# Altium project MU_MP_39_V1.PrjPcb (part 1 of 5)
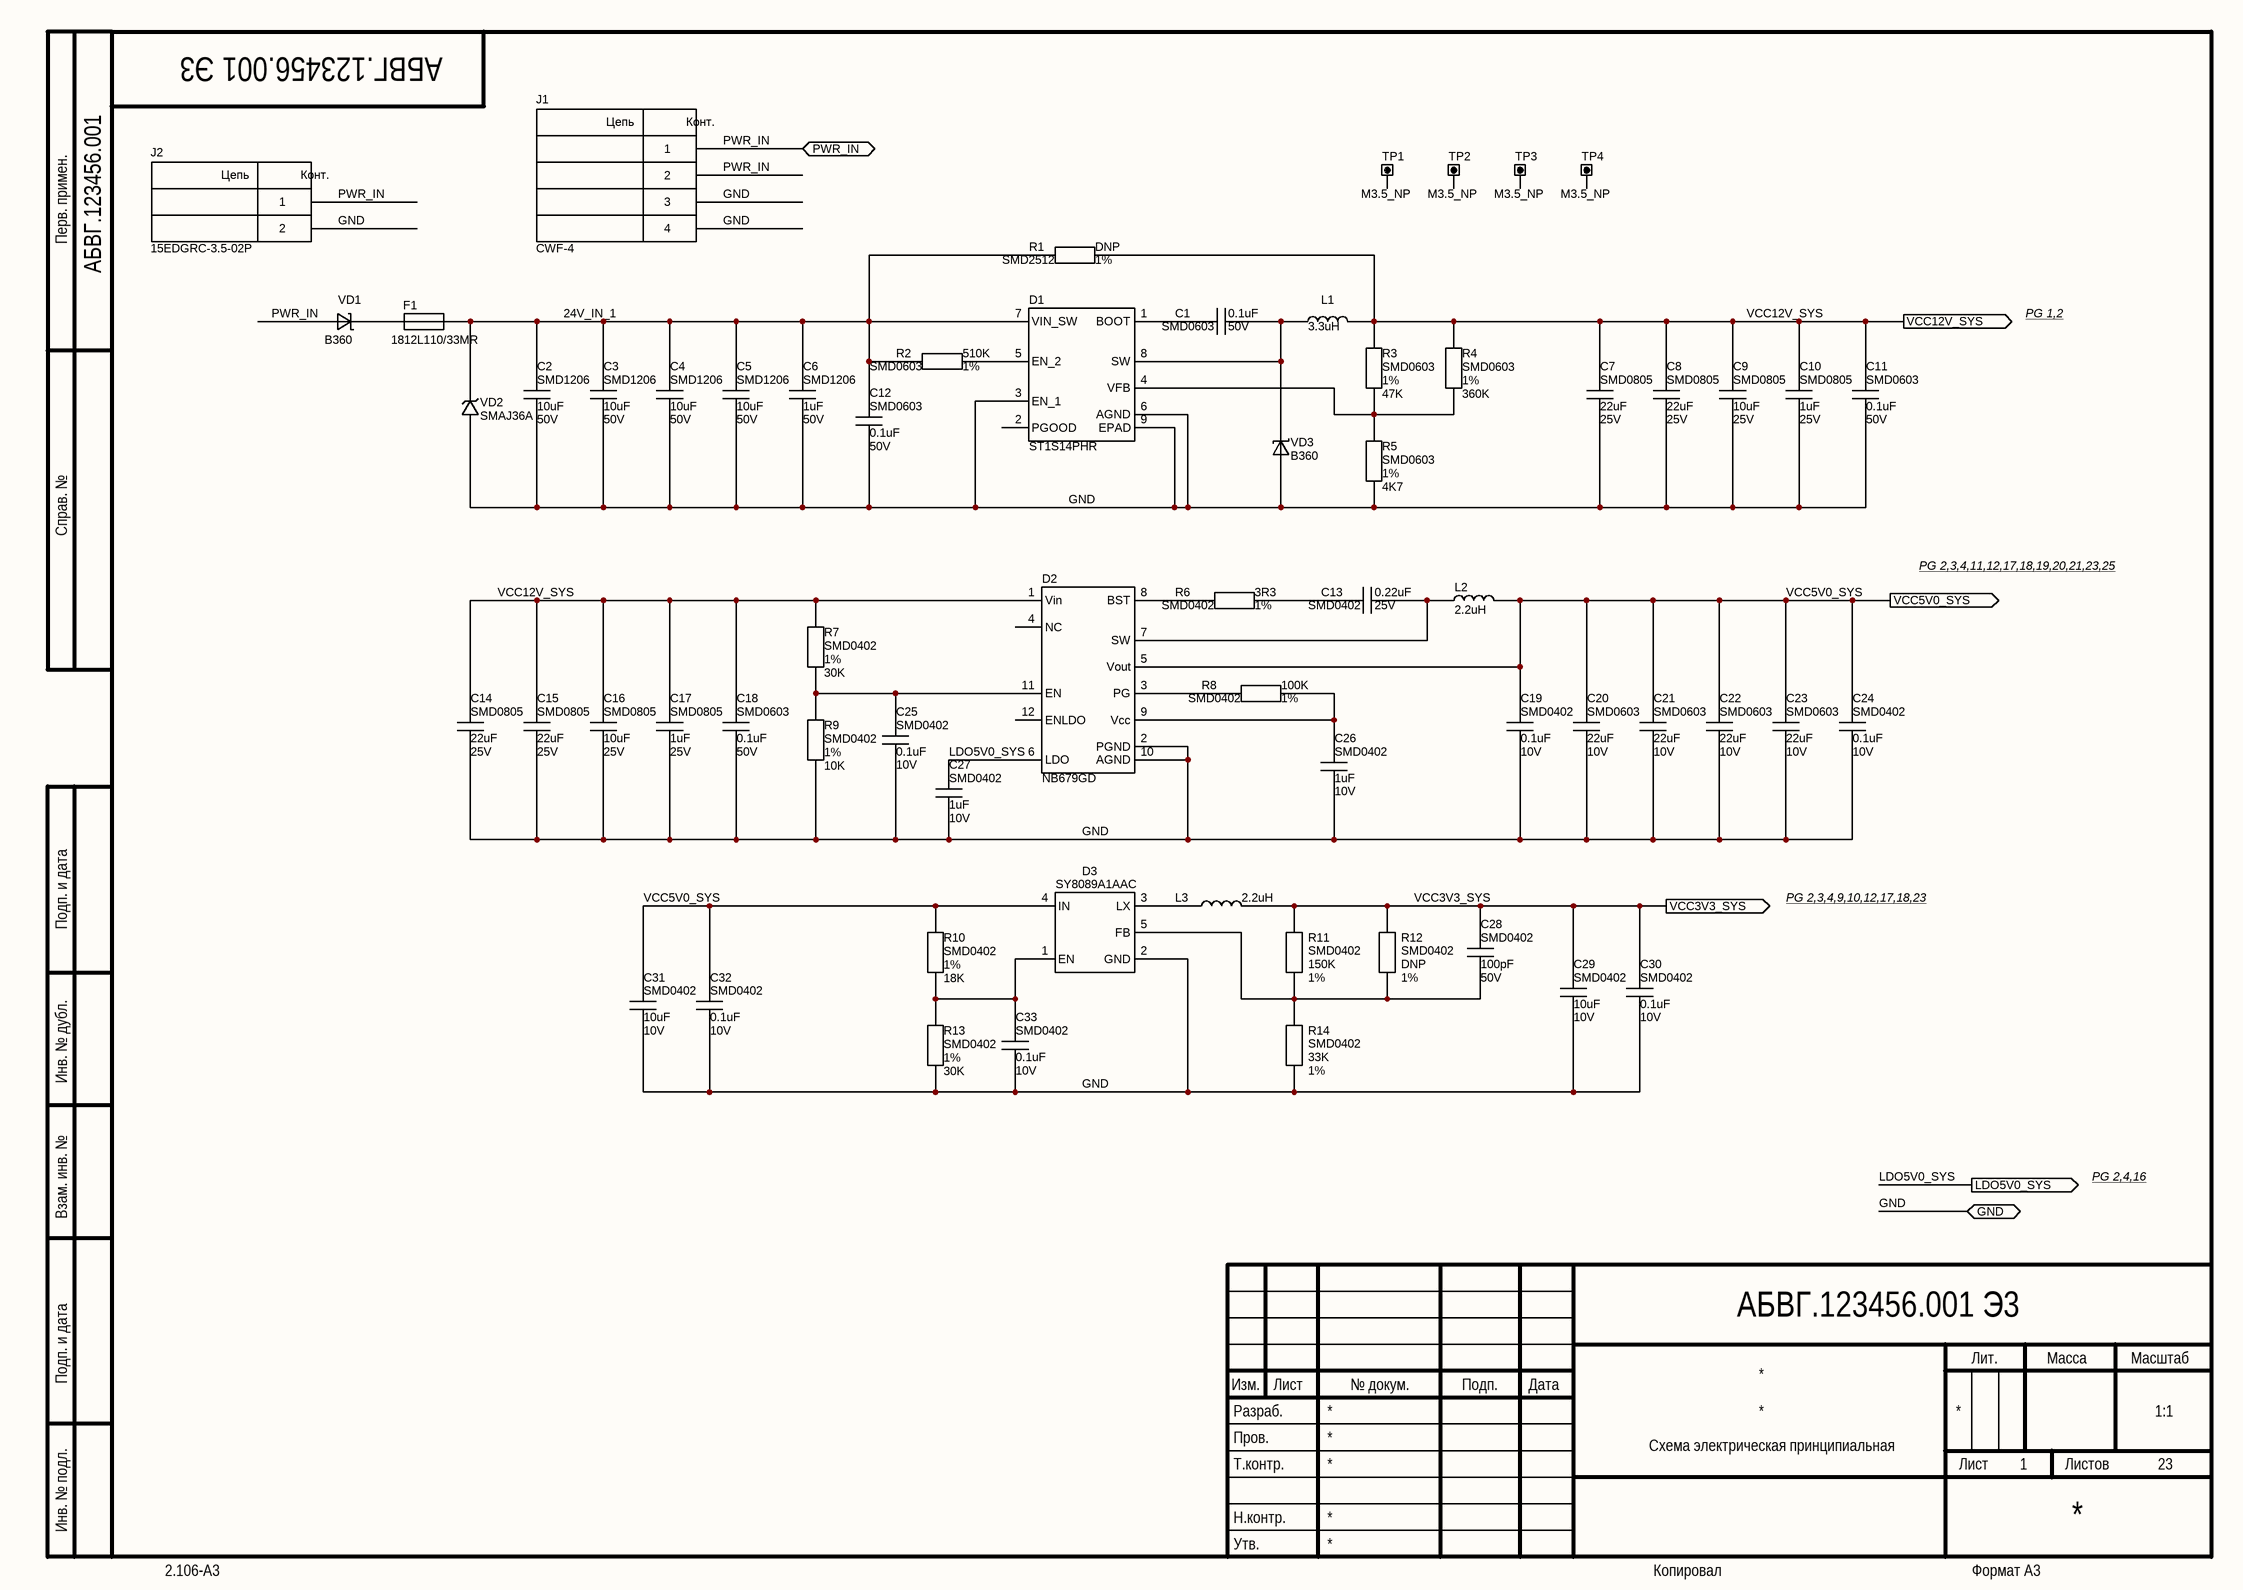
[diagram p0: 01 INPUT_PWR.SchDoc]
23 sheets, 934 parts. Net scope: flat (ports and power ports of the same name join across sheets).
Board file: MU_MP_39_V1.PcbDoc
Sheets:
  01 INPUT_PWR.SchDoc
  02 INPUT_PWR_2.SchDoc
  03 RK808.SchDoc
  04 POWER.SchDoc
  05 CPU_PWR.SchDoc
  06 CPU_RAM.SchDoc
  07 RAM_PWR.SchDoc
  08 RAM.SchDoc
  09 EMMC.SchDoc
  10 SDMMC.SchDoc
  11 USB_2.SchDoc
  12 USB_3.SchDoc
  13 CPU_1.SchDoc
  14 CPU_2.SchDoc
  15 ETHERNET.SchDoc
  16 HDMI.SchDoc
  17 EDP.SchDoc
  18 I2S.SchDoc
  19 RADIATOR.SchDoc
  20 WiFi_BT.SchDoc
  21 CAN.SchDoc
  22 PCIE.SchDoc
  23 Unused.SchDoc

## Sheet 01 INPUT_PWR.SchDoc
size 420 x 297 mm; Address1: Address1; Address2: Address2; Address3: Address3; Address4: Address4; DocumentNumber: АБВГ.123456.001 Э3; SheetNumber: 1; SheetTotal: 23; Scale: 1:1; DocumentType: Схема электрическая принципиальная; FirstReferrence: АБВГ.123456.001

### Parts
C1  Package: SMD0603  Voltage: 50V  [CAP_SMD_0603]  (hidden comment: 0.1uF)
C2  Package: SMD1206  Voltage: 50V  [CAP_SMD_1206]  (hidden comment: 10uF)
C3  Package: SMD1206  Voltage: 50V  [CAP_SMD_1206]  (hidden comment: 10uF)
C4  Package: SMD1206  Voltage: 50V  [CAP_SMD_1206]  (hidden comment: 10uF)
C5  Package: SMD1206  Voltage: 50V  [CAP_SMD_1206]  (hidden comment: 10uF)
C6  Package: SMD1206  Voltage: 50V  [CAP_SMD_1206]  (hidden comment: 1uF)
C7  Package: SMD0805  Voltage: 25V  [CAP_SMD_0805]  (hidden comment: 22uF)
C8  Package: SMD0805  Voltage: 25V  [CAP_SMD_0805]  (hidden comment: 22uF)
C9  Package: SMD0805  Voltage: 25V  [CAP_SMD_0805]  (hidden comment: 10uF)
C10  Package: SMD0805  Voltage: 25V  [CAP_SMD_0805]  (hidden comment: 1uF)
C11  Package: SMD0603  Voltage: 50V  [CAP_SMD_0603]  (hidden comment: 0.1uF)
C12  Package: SMD0603  Voltage: 50V  [CAP_SMD_0603]  (hidden comment: 0.1uF)
C13  Package: SMD0402  Voltage: 25V  [CAP_SMD_0402]  (hidden comment: 0.22uF)
C14  Package: SMD0805  Voltage: 25V  [CAP_SMD_0805]  (hidden comment: 22uF)
C15  Package: SMD0805  Voltage: 25V  [CAP_SMD_0805]  (hidden comment: 22uF)
C16  Package: SMD0805  Voltage: 25V  [CAP_SMD_0805]  (hidden comment: 10uF)
C17  Package: SMD0805  Voltage: 25V  [CAP_SMD_0805]  (hidden comment: 1uF)
C18  Package: SMD0603  Voltage: 50V  [CAP_SMD_0603]  (hidden comment: 0.1uF)
C19  Package: SMD0402  Voltage: 10V  [CAP_SMD_0402]  (hidden comment: 0.1uF)
C20  Package: SMD0603  Voltage: 10V  [CAP_SMD_0603]  (hidden comment: 22uF)
C21  Package: SMD0603  Voltage: 10V  [CAP_SMD_0603]  (hidden comment: 22uF)
C22  Package: SMD0603  Voltage: 10V  [CAP_SMD_0603]  (hidden comment: 22uF)
C23  Package: SMD0603  Voltage: 10V  [CAP_SMD_0603]  (hidden comment: 22uF)
C24  Package: SMD0402  Voltage: 10V  [CAP_SMD_0402]  (hidden comment: 0.1uF)
C25  Package: SMD0402  Voltage: 10V  [CAP_SMD_0402]  (hidden comment: 0.1uF)
C26  Package: SMD0402  Voltage: 10V  [CAP_SMD_0402]  (hidden comment: 1uF)
C27  Package: SMD0402  Voltage: 10V  [CAP_SMD_0402]  (hidden comment: 1uF)
C28  Package: SMD0402  Voltage: 50V  [CAP_SMD_0402]  (hidden comment: 100pF)
C29  Package: SMD0402  Voltage: 10V  [CAP_SMD_0402]  (hidden comment: 10uF)
C30  Package: SMD0402  Voltage: 10V  [CAP_SMD_0402]  (hidden comment: 0.1uF)
C31  Package: SMD0402  Voltage: 10V  [CAP_SMD_0402]  (hidden comment: 10uF)
C32  Package: SMD0402  Voltage: 10V  [CAP_SMD_0402]  (hidden comment: 0.1uF)
C33  Package: SMD0402  Voltage: 10V  [CAP_SMD_0402]  (hidden comment: 0.1uF)
D1  ST1S14PHR  [SO8_PWR]
D2  NB679GD  [QFN-12_2mmx3mm]
D3  SY8089A1AAC  [SOT23-5]
F1  value 1812L110/33MR  [FUSE_SMD_1812]  (hidden comment: Value)
J1  CWF-4  [CWF-4]
J2  15EDGRC-3.5-02P  [15EDGRC-3.5-02P]
L1  value 3.3uH  [IHLP2020]  (hidden comment: Value)
L2  value 2.2uH  [IHLP2020]  (hidden comment: Value)
L3  value 2.2uH  [HEI252012A]  (hidden comment: Value)
R1  Package: SMD2512  Tolerance: 1%  [RES_SMD_2512]  (hidden comment: DNP)
R2  Package: SMD0603  Tolerance: 1%  [RES_SMD_0603]  (hidden comment: 510K)
R3  Package: SMD0603  Tolerance: 1%  [RES_SMD_0603]  (hidden comment: 47K)
R4  Package: SMD0603  Tolerance: 1%  [RES_SMD_0603]  (hidden comment: 360K)
R5  Package: SMD0603  Tolerance: 1%  [RES_SMD_0603]  (hidden comment: 4K7)
R6  Package: SMD0402  Tolerance: 1%  [RES_SMD_0402]  (hidden comment: 3R3)
R7  Package: SMD0402  Tolerance: 1%  [RES_SMD_0402]  (hidden comment: 30K)
R8  Package: SMD0402  Tolerance: 1%  [RES_SMD_0402]  (hidden comment: 100K)
R9  Package: SMD0402  Tolerance: 1%  [RES_SMD_0402]  (hidden comment: 10K)
R10  Package: SMD0402  Tolerance: 1%  [RES_SMD_0402]  (hidden comment: 18K)
R11  Package: SMD0402  Tolerance: 1%  [RES_SMD_0402]  (hidden comment: 150K)
R12  Package: SMD0402  Tolerance: 1%  [RES_SMD_0402]  (hidden comment: DNP)
R13  Package: SMD0402  Tolerance: 1%  [RES_SMD_0402]  (hidden comment: 30K)
R14  Package: SMD0402  Tolerance: 1%  [RES_SMD_0402]  (hidden comment: 33K)
TP1  M3.5_NP  [M3.5_NP]
TP2  M3.5_NP  [M3.5_NP]
TP3  M3.5_NP  [M3.5_NP]
TP4  M3.5_NP  [M3.5_NP]
VD1  value B360  [SMA]  (hidden comment: Value)
VD2  SMAJ36A  [SMA]
VD3  value B360  [SMA]  (hidden comment: Value)

### Ports
GND (bidir), LDO5V0_SYS (out), PWR_IN (bidir), VCC3V3_SYS (out), VCC5V0_SYS (out), VCC12V_SYS (out)

### Nets
24V_IN_1: C2.2 C3.2 C4.2 C5.2 C6.2 C12.2 D1.7(VIN_SW) F1.2 R1.1 R2.1 VD2.2(C)
GND: C2.1 C3.1 C4.1 C5.1 C6.1 C7.1 C8.1 C9.1 C10.1 C11.1 C12.1 C14.1 C15.1 C16.1 C17.1 C18.1 C19.2 C20.1 C21.1 C22.1 C23.1 C24.2 C25.2 C26.2 C27.2 C29.2 C30.2 C31.2 C32.2 C33.2 D1.3(EN_1) D1.6(AGND) D1.9(EPAD) D2.2(PGND) D2.10(AGND) D3.2(GND) J1.3 J1.4 J2.2 R5.1 R9.1 R13.1 R14.1 VD2.1(A) VD3.1(A) ; port GND
LDO5V0_SYS: C27.1 D2.6(LDO) ; port LDO5V0_SYS
PWR_IN: J1.1 J1.2 J2.1 VD1.1(A) ; port PWR_IN
VCC3V3_SYS: C28.1 C29.1 C30.1 L3.1 R11.2 R12.2 ; port VCC3V3_SYS
VCC5V0_SYS: C19.1 C20.2 C21.2 C22.2 C23.2 C24.1 C31.1 C32.1 D2.5(Vout) D3.4(IN) L2.1 R10.2 ; port VCC5V0_SYS
VCC12V_SYS: C7.2 C8.2 C9.2 C10.2 C11.2 C14.2 C15.2 C16.2 C17.2 C18.2 D2.1(Vin) L1.1 R1.2 R3.2 R4.2 R7.2 ; port VCC12V_SYS
NetC1_1: C1.1 D1.8(SW) L1.2 VD3.2(C)
NetC1_2: C1.2 D1.1(BOOT)
NetC13_1: C13.1 D2.7(SW) L2.2
NetC13_2: C13.2 R6.2
NetC25_1: C25.1 D2.11(EN) R7.1 R9.2
NetC26_1: C26.1 D2.9(Vcc) R8.1
NetC28_2: C28.2 D3.5(FB) R11.1 R12.1 R14.2
NetC33_1: C33.1 D3.1(EN) R10.1 R13.2
NetD1_4: D1.4(VFB) R3.1 R4.1 R5.2
NetD1_5: D1.5(EN_2) R2.2
NetD2_3: D2.3(PG) R8.2
NetD2_8: D2.8(BST) R6.1
NetD3_3: D3.3(LX) L3.2
NetF1_1: F1.1 VD1.2(C)

Not connected (* = marked no-connect by the designer): D1 2(PGOOD); D2 4(NC) 12(ENLDO); TP1 1; TP2 1; TP3 1; TP4 1

### Notes on the sheet
- Перв. примен.
- PG 1,2
- Справ. №
- PG 2,3,4,11,12,17,18,19,20,21,23,25
- Подп. и дата
- PG 2,3,4,9,10,12,17,18,23
- Инв. № дубл.
- PG 2,4,16
- Взам. инв. №
- Разраб.
- Изм.
- Лист
- № докум.
- Подп.
- Дата
- Лит.
- Масса
- Масштаб
- Пров.
- Т.контр.
- Листов
- Инв. № подл.
- Утв.
- Н.контр.
- 2.106-A3
- Копировал
- Формат А3
- (in symbol CON2) Цепь; Конт.
- (in symbol CON4) Цепь; Конт.

### Library data of the parts
C1 C11 C12 C18 = Ceramic_Cap: PartNumber: CC0603KRX7R9BB104; ComponentType: SMD Ceramic Chip Capacitor; Manufacter: *; Tolerance: *; ClassName: *; Value: 0.1uF
C2-C5 = Ceramic_Cap: PartNumber: CL31B106KBHNNNE; ComponentType: SMD Ceramic Chip Capacitor; Manufacter: *; Tolerance: *; ClassName: *; Value: 10uF
C6 = Ceramic_Cap: PartNumber: CC1206MRY5V9BB105; ComponentType: SMD Ceramic Chip Capacitor; Manufacter: *; Tolerance: *; ClassName: *; Value: 1uF
C7 C8 C14 C15 = Ceramic_Cap: PartNumber: CC0805MKX5R8BB226; ComponentType: SMD Ceramic Chip Capacitor; Manufacter: *; Tolerance: *; ClassName: *; Value: 22uF
C9 C16 = Ceramic_Cap: PartNumber: CL21A106KAYNNNE; ComponentType: SMD Ceramic Chip Capacitor; Manufacter: *; Tolerance: *; ClassName: *; Value: 10uF
C10 C17 = Ceramic_Cap: PartNumber: CC0805KKX7R8BB105; ComponentType: SMD Ceramic Chip Capacitor; Manufacter: *; Tolerance: *; ClassName: *; Value: 1uF
C13 = Ceramic_Cap: PartNumber: CC0402KRX5R8BB224; ComponentType: SMD Ceramic Chip Capacitor; Manufacter: *; Tolerance: *; ClassName: *; Value: 0.22uF
C19 C24 C25 C30 C32 C33 = Ceramic_Cap: PartNumber: CC0402KRX5R6BB104; ComponentType: SMD Ceramic Chip Capacitor; Manufacter: *; Tolerance: *; ClassName: *; Value: 0.1uF
C20-C23 = Ceramic_Cap: PartNumber: CL10A226MP8NUNE; ComponentType: SMD Ceramic Chip Capacitor; Manufacter: *; Tolerance: *; ClassName: *; Value: 22uF
C26 C27 = Ceramic_Cap: PartNumber: CC0402KRX5R6BB105; ComponentType: SMD Ceramic Chip Capacitor; Manufacter: *; Tolerance: *; ClassName: *; Value: 1uF
C28 = Ceramic_Cap: PartNumber: CC0402KRNPO9BN101; ComponentType: SMD Ceramic Chip Capacitor; Manufacter: *; Tolerance: *; ClassName: *; Value: 100pF
C29 C31 = Ceramic_Cap: PartNumber: CC0402MRX5R6BB106; ComponentType: SMD Ceramic Chip Capacitor; Manufacter: *; Tolerance: *; ClassName: *; Value: 10uF
D1 = ST1S14: Manufacter: ST; ComponentType: step-down switching regulator; Package: Power SO8; PartNumber: ST1S14PHR; ClassName: *; Value: ST1S14PHR
D3 = SY8088AAC: ComponentType: SMD Chip Resistor; Manufacter: *; Voltage: *; ClassName: *; Tolerance: *; PartNumber: SY8089A1AAC; Package: SOT23-5; Value: SY8089A1AAC
F1 = Fuse: ComponentType: *; Manufacter: *; Package: SMD1812; PartNumber: 1812L110/33MR; ClassName: *
J1 = CON4: PartNumber: DS1069-4MVW6X (CWF-4); Manufacter: *; Package: CWF-4; ClassName: *; Value: CWF-4
J2 = CON2: ComponentType: *; Manufacter: *; Package: 15EDGRC-3.5-02P; PartNumber: 15EDGRC-3.5-02P; ClassName: *; Value: 15EDGRC-3.5-02P
L1 = Inductor_smal: PartNumber: IHLP2020CZER3R3M01; ComponentType: *; Manufacter: *; Package: IHLP2020; ClassName: *
L2 = Inductor_smal: PartNumber: IHLP2020CZER2R2M01; ComponentType: *; Manufacter: *; Package: IHLP2020; ClassName: *
L3 = Inductor_smal: PartNumber: HEI252012A-2R2M-Q8; ComponentType: *; Manufacter: *; Package: HEI252012A; ClassName: *
R1 = Chip_Res: PartNumber: RC2512FK-070RL; ComponentType: SMD Chip Resistor; Manufacter: *; Voltage: *; ClassName: *; Value: DNP
R2 = Chip_Res: PartNumber: RC0603FR-07510KL; ComponentType: SMD Chip Resistor; Manufacter: *; Voltage: *; ClassName: *; Value: 510K
R3 = Chip_Res: PartNumber: RC0603FR-0747KL; ComponentType: SMD Chip Resistor; Manufacter: *; Voltage: *; ClassName: *; Value: 47K
R4 = Chip_Res: PartNumber: RC0603FR-07360KL; ComponentType: SMD Chip Resistor; Manufacter: *; Voltage: *; ClassName: *; Value: 360K
R5 = Chip_Res: PartNumber: RC0603FR-074K7L; ComponentType: SMD Chip Resistor; Manufacter: *; Voltage: *; ClassName: *; Value: 4K7
R6 = Chip_Res: PartNumber: RC0402FR-073R3L; ComponentType: SMD Chip Resistor; Manufacter: *; Voltage: *; ClassName: *; Value: 3R3
R7 R13 = Chip_Res: PartNumber: RC0402FR-0730KL; ComponentType: SMD Chip Resistor; Manufacter: *; Voltage: *; ClassName: *; Value: 30K
R8 = Chip_Res: PartNumber: RC0402FR-07100KL; ComponentType: SMD Chip Resistor; Manufacter: *; Voltage: *; ClassName: *; Value: 100K
R9 = Chip_Res: PartNumber: RC0402FR-0710KL; ComponentType: SMD Chip Resistor; Manufacter: *; Voltage: *; ClassName: *; Value: 10K
R10 = Chip_Res: PartNumber: RC0402FR-0718KL; ComponentType: SMD Chip Resistor; Manufacter: *; Voltage: *; ClassName: *; Value: 18K
R11 = Chip_Res: PartNumber: RC0402FR-07150KL; ComponentType: SMD Chip Resistor; Manufacter: *; Voltage: *; ClassName: *; Value: 150K
R12 = Chip_Res: PartNumber: Do Not Place; ComponentType: SMD Chip Resistor; Manufacter: *; Voltage: *; ClassName: *; Value: DNP
R14 = Chip_Res: PartNumber: RC0402FR-0733KL; ComponentType: SMD Chip Resistor; Manufacter: *; Voltage: *; ClassName: *; Value: 33K
TP1-TP4 = TP: ComponentType: *; Manufacter: *; Package: *; PartNumber: *; ClassName: *; Value: M3.5_NP
VD1 VD3 = ShottkyDiode: ComponentType: *; Manufacter: *; Package: SMA; PartNumber: B360; ClassName: *
VD2 = ZenerDiode: ComponentType: *; Manufacter: *; Package: SMA; PartNumber: SMAJ36A; ClassName: *; Value: SMAJ36A
D2 = NB679GD: ComponentType: SMD Chip Resistor; Manufacter: *; Voltage: *; ClassName: *; Tolerance: *; PartNumber: NB679GD; Package: QFN-12; Value: NB679GD

## Sheet 02 INPUT_PWR_2.SchDoc
size 420 x 297 mm; Address1: Address1; Address2: Address2; Address3: Address3; Address4: Address4; DocumentNumber: АБВГ.123456.001 Э3; SheetNumber: 2; SheetTotal: 23; Scale: 1:1; DocumentType: Схема электрическая принципиальная; FirstReferrence: АБВГ.123456.001
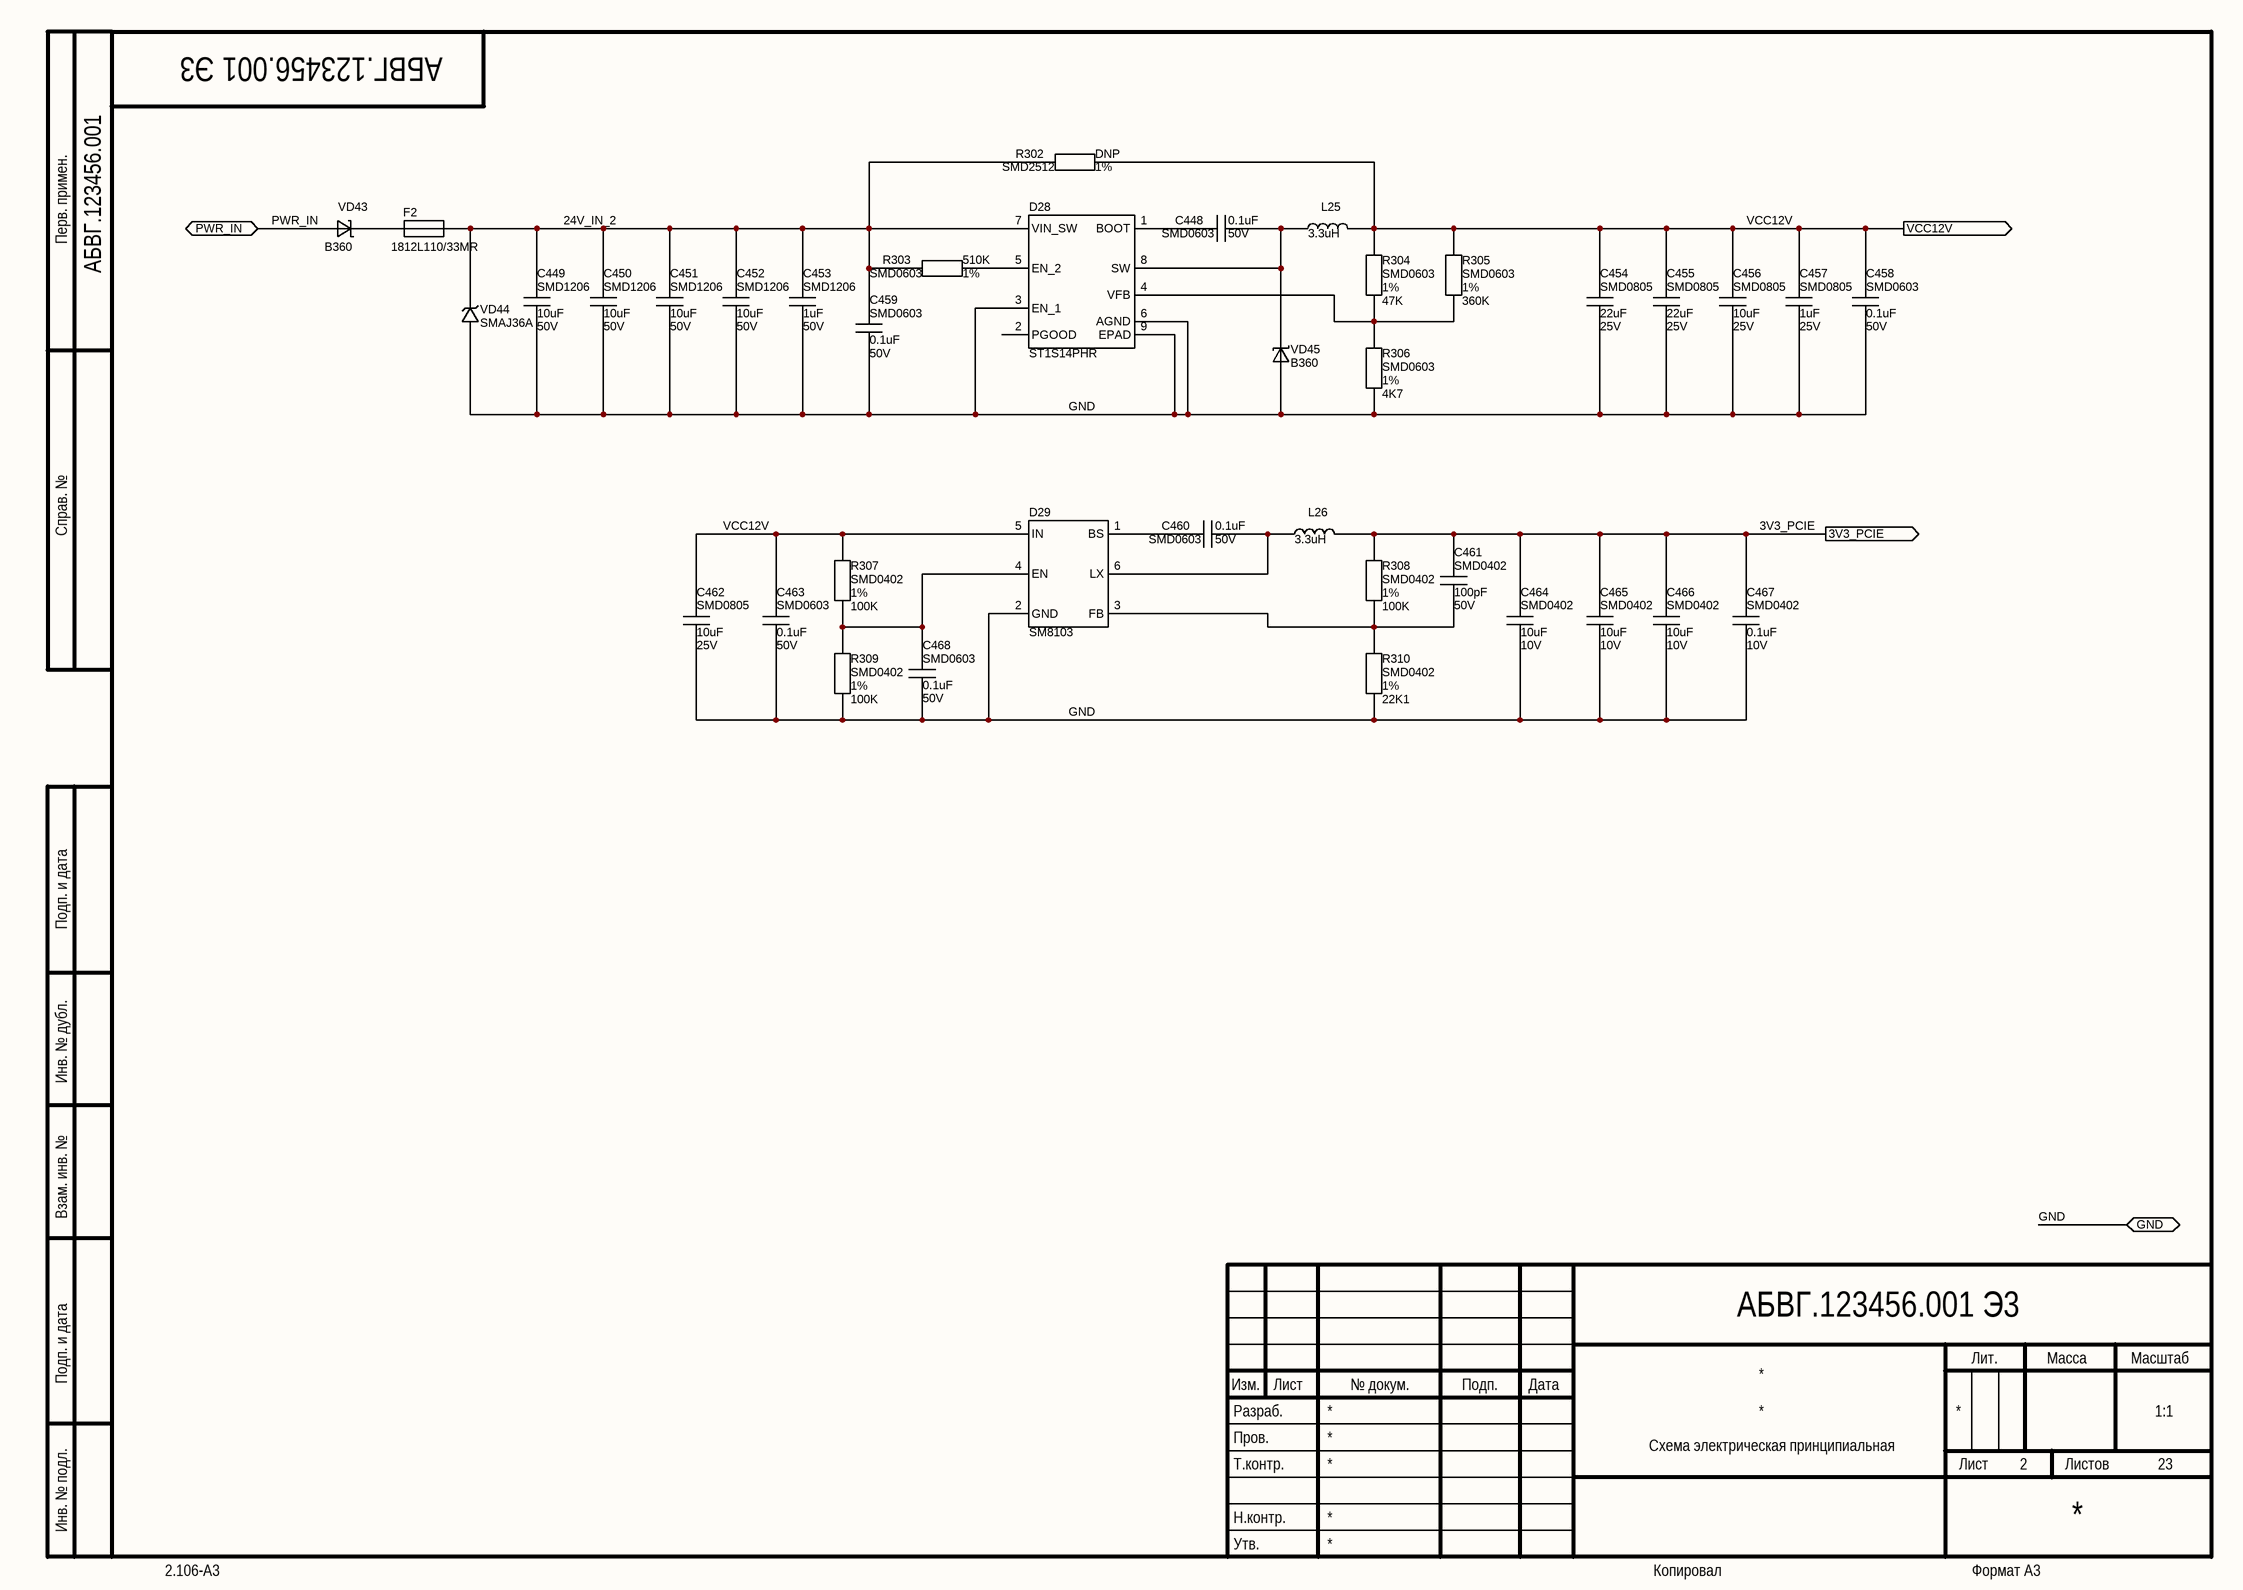
[diagram p1: 02 INPUT_PWR_2.SchDoc]

### Parts
C448  Package: SMD0603  Voltage: 50V  [CAP_SMD_0603]  (hidden comment: 0.1uF)
C449  Package: SMD1206  Voltage: 50V  [CAP_SMD_1206]  (hidden comment: 10uF)
C450  Package: SMD1206  Voltage: 50V  [CAP_SMD_1206]  (hidden comment: 10uF)
C451  Package: SMD1206  Voltage: 50V  [CAP_SMD_1206]  (hidden comment: 10uF)
C452  Package: SMD1206  Voltage: 50V  [CAP_SMD_1206]  (hidden comment: 10uF)
C453  Package: SMD1206  Voltage: 50V  [CAP_SMD_1206]  (hidden comment: 1uF)
C454  Package: SMD0805  Voltage: 25V  [CAP_SMD_0805]  (hidden comment: 22uF)
C455  Package: SMD0805  Voltage: 25V  [CAP_SMD_0805]  (hidden comment: 22uF)
C456  Package: SMD0805  Voltage: 25V  [CAP_SMD_0805]  (hidden comment: 10uF)
C457  Package: SMD0805  Voltage: 25V  [CAP_SMD_0805]  (hidden comment: 1uF)
C458  Package: SMD0603  Voltage: 50V  [CAP_SMD_0603]  (hidden comment: 0.1uF)
C459  Package: SMD0603  Voltage: 50V  [CAP_SMD_0603]  (hidden comment: 0.1uF)
C460  Package: SMD0603  Voltage: 50V  [CAP_SMD_0603]  (hidden comment: 0.1uF)
C461  Package: SMD0402  Voltage: 50V  [CAP_SMD_0402]  (hidden comment: 100pF)
C462  Package: SMD0805  Voltage: 25V  [CAP_SMD_0805]  (hidden comment: 10uF)
C463  Package: SMD0603  Voltage: 50V  [CAP_SMD_0603]  (hidden comment: 0.1uF)
C464  Package: SMD0402  Voltage: 10V  [CAP_SMD_0402]  (hidden comment: 10uF)
C465  Package: SMD0402  Voltage: 10V  [CAP_SMD_0402]  (hidden comment: 10uF)
C466  Package: SMD0402  Voltage: 10V  [CAP_SMD_0402]  (hidden comment: 10uF)
C467  Package: SMD0402  Voltage: 10V  [CAP_SMD_0402]  (hidden comment: 0.1uF)
C468  Package: SMD0603  Voltage: 50V  [CAP_SMD_0603]  (hidden comment: 0.1uF)
D28  ST1S14PHR  [SO8_PWR]
D29  SM8103  [SOT23-6]
F2  value 1812L110/33MR  [FUSE_SMD_1812]  (hidden comment: Value)
L25  value 3.3uH  [IHLP2020]  (hidden comment: Value)
L26  value 3.3uH  [IHLP2020]  (hidden comment: Value)
R302  Package: SMD2512  Tolerance: 1%  [RES_SMD_2512]  (hidden comment: DNP)
R303  Package: SMD0603  Tolerance: 1%  [RES_SMD_0603]  (hidden comment: 510K)
R304  Package: SMD0603  Tolerance: 1%  [RES_SMD_0603]  (hidden comment: 47K)
R305  Package: SMD0603  Tolerance: 1%  [RES_SMD_0603]  (hidden comment: 360K)
R306  Package: SMD0603  Tolerance: 1%  [RES_SMD_0603]  (hidden comment: 4K7)
R307  Package: SMD0402  Tolerance: 1%  [RES_SMD_0402]  (hidden comment: 100K)
R308  Package: SMD0402  Tolerance: 1%  [RES_SMD_0402]  (hidden comment: 100K)
R309  Package: SMD0402  Tolerance: 1%  [RES_SMD_0402]  (hidden comment: 100K)
R310  Package: SMD0402  Tolerance: 1%  [RES_SMD_0402]  (hidden comment: 22K1)
VD43  value B360  [SMA]  (hidden comment: Value)
VD44  SMAJ36A  [SMA]
VD45  value B360  [SMA]  (hidden comment: Value)

### Ports
3V3_PCIE (out), GND (bidir), PWR_IN (bidir), VCC12V (out)

### Nets
3V3_PCIE: C461.1 C464.1 C465.1 C466.1 C467.1 L26.1 R308.2 ; port 3V3_PCIE
24V_IN_2: C449.2 C450.2 C451.2 C452.2 C453.2 C459.2 D28.7(VIN_SW) F2.2 R302.1 R303.1 VD44.2(C)
GND: C449.1 C450.1 C451.1 C452.1 C453.1 C454.1 C455.1 C456.1 C457.1 C458.1 C459.1 C462.1 C463.1 C464.2 C465.2 C466.2 C467.2 C468.1 D28.3(EN_1) D28.6(AGND) D28.9(EPAD) D29.2(GND) R306.1 R309.1 R310.1 VD44.1(A) VD45.1(A) ; port GND
PWR_IN: VD43.1(A) ; port PWR_IN
VCC12V: C454.2 C455.2 C456.2 C457.2 C458.2 C462.2 C463.2 D29.5(IN) L25.1 R302.2 R304.2 R305.2 R307.2 ; port VCC12V
NetC448_1: C448.1 D28.8(SW) L25.2 VD45.2(C)
NetC448_2: C448.2 D28.1(BOOT)
NetC460_1: C460.1 D29.6(LX) L26.2
NetC460_2: C460.2 D29.1(BS)
NetC461_2: C461.2 D29.3(FB) R308.1 R310.2
NetC468_2: C468.2 D29.4(EN) R307.1 R309.2
NetD28_4: D28.4(VFB) R304.1 R305.1 R306.2
NetD28_5: D28.5(EN_2) R303.2
NetF2_1: F2.1 VD43.2(C)

Not connected (* = marked no-connect by the designer): D28 2(PGOOD)

### Notes on the sheet
- Перв. примен.
- Справ. №
- Подп. и дата
- Инв. № дубл.
- Взам. инв. №
- Разраб.
- Изм.
- Лист
- № докум.
- Подп.
- Дата
- Лит.
- Масса
- Масштаб
- Пров.
- Т.контр.
- Листов
- Инв. № подл.
- Утв.
- Н.контр.
- 2.106-A3
- Копировал
- Формат А3

### Library data of the parts
C448 C458-C460 C463 C468 = Ceramic_Cap: PartNumber: CC0603KRX7R9BB104; ComponentType: SMD Ceramic Chip Capacitor; Manufacter: *; Tolerance: *; ClassName: *; Value: 0.1uF
C449-C452 = Ceramic_Cap: PartNumber: CL31B106KBHNNNE; ComponentType: SMD Ceramic Chip Capacitor; Manufacter: *; Tolerance: *; ClassName: *; Value: 10uF
C453 = Ceramic_Cap: PartNumber: CC1206MRY5V9BB105; ComponentType: SMD Ceramic Chip Capacitor; Manufacter: *; Tolerance: *; ClassName: *; Value: 1uF
C454 C455 = Ceramic_Cap: PartNumber: CC0805MKX5R8BB226; ComponentType: SMD Ceramic Chip Capacitor; Manufacter: *; Tolerance: *; ClassName: *; Value: 22uF
C456 C462 = Ceramic_Cap: PartNumber: CL21A106KAYNNNE; ComponentType: SMD Ceramic Chip Capacitor; Manufacter: *; Tolerance: *; ClassName: *; Value: 10uF
C457 = Ceramic_Cap: PartNumber: CC0805KKX7R8BB105; ComponentType: SMD Ceramic Chip Capacitor; Manufacter: *; Tolerance: *; ClassName: *; Value: 1uF
C461 = Ceramic_Cap: PartNumber: CC0402KRNPO9BN101; ComponentType: SMD Ceramic Chip Capacitor; Manufacter: *; Tolerance: *; ClassName: *; Value: 100pF
C464-C466 = Ceramic_Cap: PartNumber: CC0402MRX5R6BB106; ComponentType: SMD Ceramic Chip Capacitor; Manufacter: *; Tolerance: *; ClassName: *; Value: 10uF
C467 = Ceramic_Cap: PartNumber: CC0402KRX5R6BB104; ComponentType: SMD Ceramic Chip Capacitor; Manufacter: *; Tolerance: *; ClassName: *; Value: 0.1uF
D28 = ST1S14: Manufacter: ST; ComponentType: step-down switching regulator; Package: Power SO8; PartNumber: ST1S14PHR; ClassName: *; Value: ST1S14PHR
D29 = SM8103: Manufacter: ST; ComponentType: step-down switching regulator; Package: TSOT23-6; PartNumber: SM8103; ClassName: *; Value: SM8103
F2 = Fuse: ComponentType: *; Manufacter: *; Package: SMD1812; PartNumber: 1812L110/33MR; ClassName: *
L25 L26 = Inductor_smal: PartNumber: IHLP2020CZER3R3M01; ComponentType: *; Manufacter: *; Package: IHLP2020; ClassName: *
R302 = Chip_Res: PartNumber: RC2512FK-070RL; ComponentType: SMD Chip Resistor; Manufacter: *; Voltage: *; ClassName: *; Value: DNP
R303 = Chip_Res: PartNumber: RC0603FR-07510KL; ComponentType: SMD Chip Resistor; Manufacter: *; Voltage: *; ClassName: *; Value: 510K
R304 = Chip_Res: PartNumber: RC0603FR-0747KL; ComponentType: SMD Chip Resistor; Manufacter: *; Voltage: *; ClassName: *; Value: 47K
R305 = Chip_Res: PartNumber: RC0603FR-07360KL; ComponentType: SMD Chip Resistor; Manufacter: *; Voltage: *; ClassName: *; Value: 360K
R306 = Chip_Res: PartNumber: RC0603FR-074K7L; ComponentType: SMD Chip Resistor; Manufacter: *; Voltage: *; ClassName: *; Value: 4K7
R307-R309 = Chip_Res: PartNumber: RC0402FR-07100KL; ComponentType: SMD Chip Resistor; Manufacter: *; Voltage: *; ClassName: *; Value: 100K
R310 = Chip_Res: PartNumber: RC0402FR-0722K1L; ComponentType: SMD Chip Resistor; Manufacter: *; Voltage: *; ClassName: *; Value: 22K1
VD43 VD45 = ShottkyDiode: ComponentType: *; Manufacter: *; Package: SMA; PartNumber: B360; ClassName: *
VD44 = ZenerDiode: ComponentType: *; Manufacter: *; Package: SMA; PartNumber: SMAJ36A; ClassName: *; Value: SMAJ36A

## Sheet 03 RK808.SchDoc
size 420 x 297 mm; Address1: Address1; Address2: Address2; Address3: Address3; Address4: Address4; DocumentNumber: АБВГ.123456.001 Э3; SheetNumber: 3; SheetTotal: 23; Scale: 1:1; DocumentType: Схема электрическая принципиальная; FirstReferrence: АБВГ.123456.001
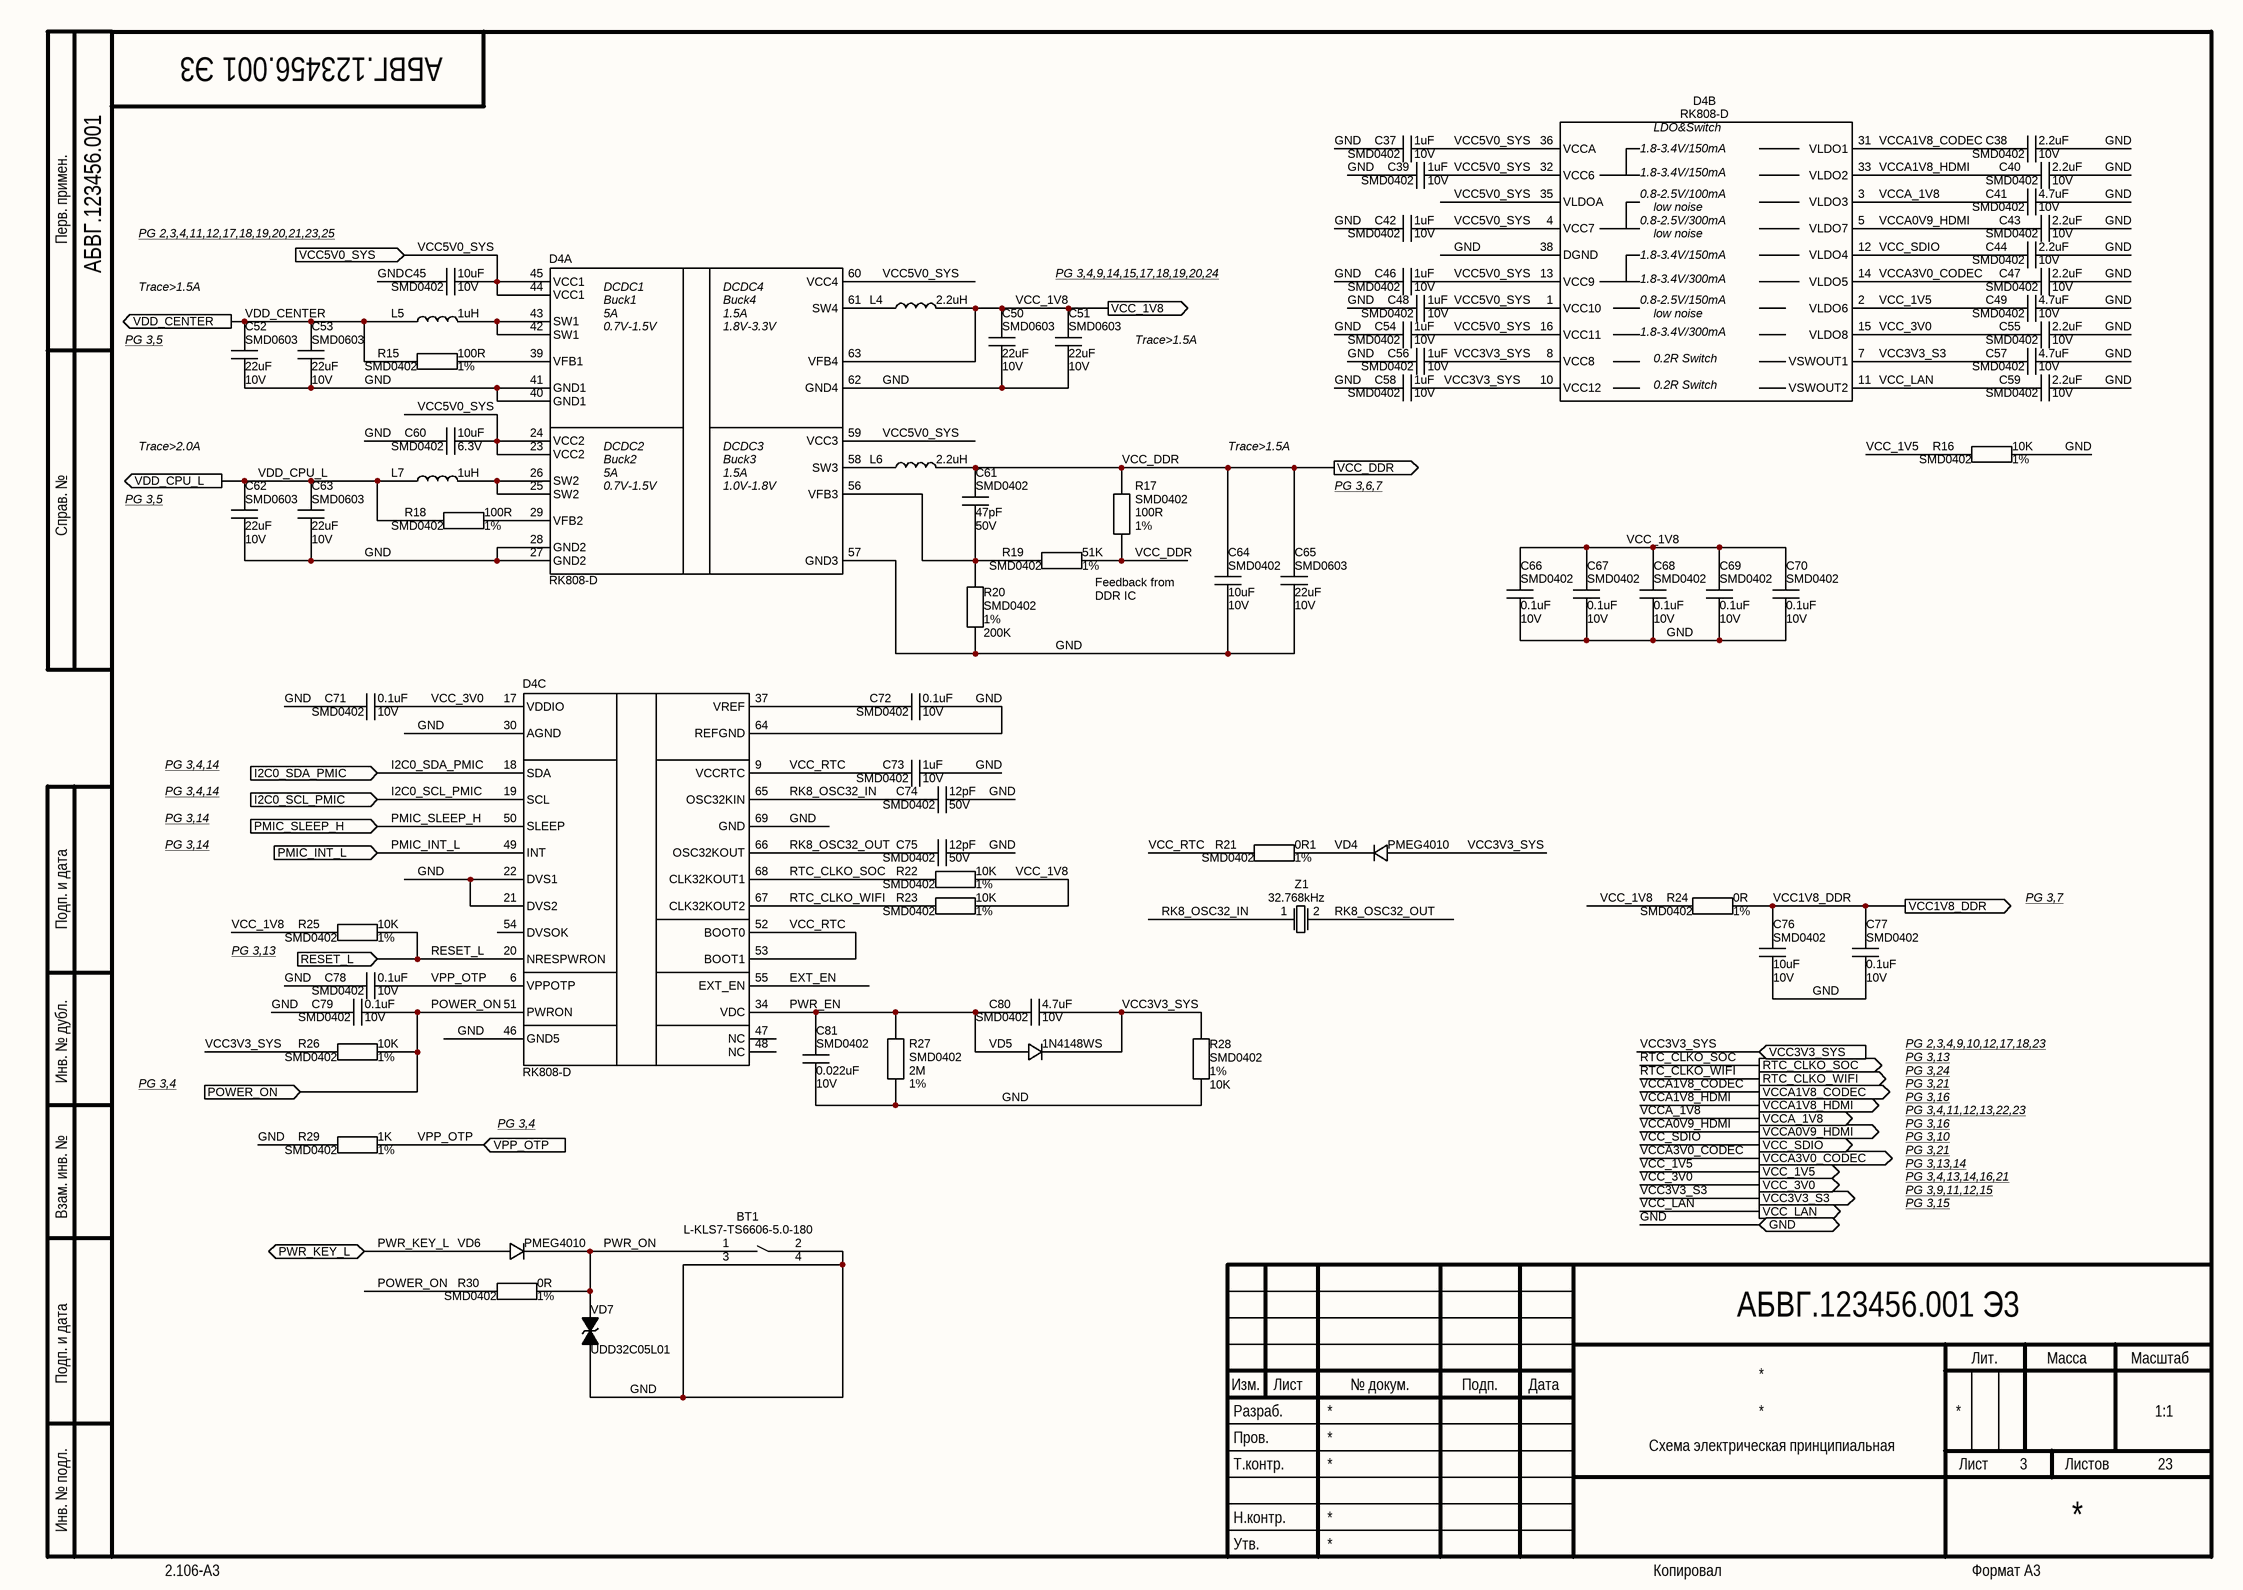
[diagram p2: 03 RK808.SchDoc]

### Parts
BT1  L-KLS7-TS6606-5.0-180  [L-KLS7-TS6606-5.0-180]
C37  Package: SMD0402  Voltage: 10V  [CAP_SMD_0402]  (hidden comment: 1uF)
C38  Package: SMD0402  Voltage: 10V  [CAP_SMD_0402]  (hidden comment: 2.2uF)
C39  Package: SMD0402  Voltage: 10V  [CAP_SMD_0402]  (hidden comment: 1uF)
C40  Package: SMD0402  Voltage: 10V  [CAP_SMD_0402]  (hidden comment: 2.2uF)
C41  Package: SMD0402  Voltage: 10V  [CAP_SMD_0402]  (hidden comment: 4.7uF)
C42  Package: SMD0402  Voltage: 10V  [CAP_SMD_0402]  (hidden comment: 1uF)
C43  Package: SMD0402  Voltage: 10V  [CAP_SMD_0402]  (hidden comment: 2.2uF)
C44  Package: SMD0402  Voltage: 10V  [CAP_SMD_0402]  (hidden comment: 2.2uF)
C45  Package: SMD0402  Voltage: 10V  [CAP_SMD_0402]  (hidden comment: 10uF)
C46  Package: SMD0402  Voltage: 10V  [CAP_SMD_0402]  (hidden comment: 1uF)
C47  Package: SMD0402  Voltage: 10V  [CAP_SMD_0402]  (hidden comment: 2.2uF)
C48  Package: SMD0402  Voltage: 10V  [CAP_SMD_0402]  (hidden comment: 1uF)
C49  Package: SMD0402  Voltage: 10V  [CAP_SMD_0402]  (hidden comment: 4.7uF)
C50  Package: SMD0603  Voltage: 10V  [CAP_SMD_0603]  (hidden comment: 22uF)
C51  Package: SMD0603  Voltage: 10V  [CAP_SMD_0603]  (hidden comment: 22uF)
C52  Package: SMD0603  Voltage: 10V  [CAP_SMD_0603]  (hidden comment: 22uF)
C53  Package: SMD0603  Voltage: 10V  [CAP_SMD_0603]  (hidden comment: 22uF)
C54  Package: SMD0402  Voltage: 10V  [CAP_SMD_0402]  (hidden comment: 1uF)
C55  Package: SMD0402  Voltage: 10V  [CAP_SMD_0402]  (hidden comment: 2.2uF)
C56  Package: SMD0402  Voltage: 10V  [CAP_SMD_0402]  (hidden comment: 1uF)
C57  Package: SMD0402  Voltage: 10V  [CAP_SMD_0402]  (hidden comment: 4.7uF)
C58  Package: SMD0402  Voltage: 10V  [CAP_SMD_0402]  (hidden comment: 1uF)
C59  Package: SMD0402  Voltage: 10V  [CAP_SMD_0402]  (hidden comment: 2.2uF)
C60  Package: SMD0402  Voltage: 6.3V  [CAP_SMD_0402]  (hidden comment: 10uF)
C61  Package: SMD0402  Voltage: 50V  [CAP_SMD_0402]  (hidden comment: 47pF)
C62  Package: SMD0603  Voltage: 10V  [CAP_SMD_0603]  (hidden comment: 22uF)
C63  Package: SMD0603  Voltage: 10V  [CAP_SMD_0603]  (hidden comment: 22uF)
C64  Package: SMD0402  Voltage: 10V  [CAP_SMD_0402]  (hidden comment: 10uF)
C65  Package: SMD0603  Voltage: 10V  [CAP_SMD_0603]  (hidden comment: 22uF)
C66  Package: SMD0402  Voltage: 10V  [CAP_SMD_0402]  (hidden comment: 0.1uF)
C67  Package: SMD0402  Voltage: 10V  [CAP_SMD_0402]  (hidden comment: 0.1uF)
C68  Package: SMD0402  Voltage: 10V  [CAP_SMD_0402]  (hidden comment: 0.1uF)
C69  Package: SMD0402  Voltage: 10V  [CAP_SMD_0402]  (hidden comment: 0.1uF)
C70  Package: SMD0402  Voltage: 10V  [CAP_SMD_0402]  (hidden comment: 0.1uF)
C71  Package: SMD0402  Voltage: 10V  [CAP_SMD_0402]  (hidden comment: 0.1uF)
C72  Package: SMD0402  Voltage: 10V  [CAP_SMD_0402]  (hidden comment: 0.1uF)
C73  Package: SMD0402  Voltage: 10V  [CAP_SMD_0402]  (hidden comment: 1uF)
C74  Package: SMD0402  Voltage: 50V  [CAP_SMD_0402]  (hidden comment: 12pF)
C75  Package: SMD0402  Voltage: 50V  [CAP_SMD_0402]  (hidden comment: 12pF)
C76  Package: SMD0402  Voltage: 10V  [CAP_SMD_0402]  (hidden comment: 10uF)
C77  Package: SMD0402  Voltage: 10V  [CAP_SMD_0402]  (hidden comment: 0.1uF)
C78  Package: SMD0402  Voltage: 10V  [CAP_SMD_0402]  (hidden comment: 0.1uF)
C79  Package: SMD0402  Voltage: 10V  [CAP_SMD_0402]  (hidden comment: 0.1uF)
C80  Package: SMD0402  Voltage: 10V  [CAP_SMD_0402]  (hidden comment: 4.7uF)
C81  Package: SMD0402  Voltage: 10V  [CAP_SMD_0402]  (hidden comment: 0.022uF)
D4  RK808-D  [QFN35P700X700X80-69N]  (parts A,B,C of 3)
L4  value 2.2uH  [HEI252012A]  (hidden comment: Value)
L5  value 1uH  [HEI252012A]  (hidden comment: Value)
L6  value 2.2uH  [HEI252012A]  (hidden comment: Value)
L7  value 1uH  [HEI252012A]  (hidden comment: Value)
R15  Package: SMD0402  Tolerance: 1%  [RES_SMD_0402]  (hidden comment: 100R)
R16  Package: SMD0402  Tolerance: 1%  [RES_SMD_0402]  (hidden comment: 10K)
R17  Package: SMD0402  Tolerance: 1%  [RES_SMD_0402]  (hidden comment: 100R)
R18  Package: SMD0402  Tolerance: 1%  [RES_SMD_0402]  (hidden comment: 100R)
R19  Package: SMD0402  Tolerance: 1%  [RES_SMD_0402]  (hidden comment: 51K)
R20  Package: SMD0402  Tolerance: 1%  [RES_SMD_0402]  (hidden comment: 200K)
R21  Package: SMD0402  Tolerance: 1%  [RES_SMD_0402]  (hidden comment: 0R1)
R22  Package: SMD0402  Tolerance: 1%  [RES_SMD_0402]  (hidden comment: 10K)
R23  Package: SMD0402  Tolerance: 1%  [RES_SMD_0402]  (hidden comment: 10K)
R24  Package: SMD0402  Tolerance: 1%  [RES_SMD_0402]  (hidden comment: 0R)
R25  Package: SMD0402  Tolerance: 1%  [RES_SMD_0402]  (hidden comment: 10K)
R26  Package: SMD0402  Tolerance: 1%  [RES_SMD_0402]  (hidden comment: 10K)
R27  Package: SMD0402  Tolerance: 1%  [RES_SMD_0402]  (hidden comment: 2M)
R28  Package: SMD0402  Tolerance: 1%  [RES_SMD_0402]  (hidden comment: 10K)
R29  Package: SMD0402  Tolerance: 1%  [RES_SMD_0402]  (hidden comment: 1K)
R30  Package: SMD0402  Tolerance: 1%  [RES_SMD_0402]  (hidden comment: 0R)
VD4  value PMEG4010  [SOD323]  (hidden comment: Diode)
VD5  value 1N4148WS  [SOD323]  (hidden comment: Diode)
VD6  value PMEG4010  [SOD323]  (hidden comment: Diode)
VD7  value UDD32C05L01  [SOD323]  (hidden comment: TVS_Diode)
Z1  value 32.768kHz  [TSX3215]  (hidden comment: Value)

### Ports
GND (bidir), I2C0_SCL_PMIC (in), I2C0_SDA_PMIC (in), PMIC_INT_L (in), PMIC_SLEEP_H (in), POWER_ON (in), PWR_KEY_L (bidir), RESET_L (in), RTC_CLKO_SOC (out), RTC_CLKO_WIFI (out), VCC1V8_DDR (out), VCC3V3_S3 (out), VCC3V3_SYS (in), VCC5V0_SYS (in), VCC_1V5 (out), VCC_1V8 (out), VCC_3V0 (out), VCC_DDR (out), VCC_LAN (out), VCC_SDIO (out), VCCA0V9_HDMI (out), VCCA1V8_CODEC (out), VCCA1V8_HDMI (out), VCCA3V0_CODEC (out), VCCA_1V8 (out), VDD_CENTER (out), VDD_CPU_L (out), VPP_OTP (in)

### Nets
EXT_EN: D4.55(EXT_EN)
GND: BT1.2 BT1.3 BT1.4 C37.2 C38.2 C39.2 C40.2 C41.2 C42.2 C43.2 C44.2 C45.1 C46.2 C47.2 C48.2 C49.2 C50.1 C51.1 C52.1 C53.1 C54.2 C55.2 C56.2 C57.2 C58.2 C59.2 C60.2 C62.1 C63.1 C64.2 C65.1 C66.2 C67.2 C68.2 C69.2 C70.2 C71.1 C72.2 C73.1 C74.1 C75.1 C76.2 C77.2 C78.1 C79.1 C81.2 D4.21(DVS2) D4.22(DVS1) D4.27(GND2) D4.28(GND2) D4.30(AGND) D4.38(DGND) D4.40(GND1) D4.41(GND1) D4.46(GND5) D4.57(GND3) D4.62(GND4) D4.64(REFGND) D4.69(GND) R16.1 R20.1 R27.1 R28.1 R29.1 VD7.1(A) ; port GND
I2C0_SCL_PMIC: D4.19(SCL) ; port I2C0_SCL_PMIC
I2C0_SDA_PMIC: D4.18(SDA) ; port I2C0_SDA_PMIC
PMIC_INT_L: D4.49(INT) ; port PMIC_INT_L
PMIC_SLEEP_H: D4.50(SLEEP) ; port PMIC_SLEEP_H
POWER_ON: C79.2 D4.51(PWRON) R26.1 R30.1 ; port POWER_ON
PWR_EN: C80.1 C81.1 D4.34(VDC) R27.2 VD5.1(A)
PWR_KEY_L: VD6.1(A) ; port PWR_KEY_L
PWR_ON: BT1.1 R30.2 VD6.2(C) VD7.2(C)
RESET_L: D4.20(NRESPWRON) R25.1 ; port RESET_L
RK8_OSC32_IN: C74.2 D4.65(OSC32KIN) Z1.1
RK8_OSC32_OUT: C75.2 D4.66(OSC32KOUT) Z1.2
RTC_CLKO_SOC: D4.68(CLK32KOUT1) R22.2 ; port RTC_CLKO_SOC
RTC_CLKO_WIFI: D4.67(CLK32KOUT2) R23.2 ; port RTC_CLKO_WIFI
VCC1V8_DDR: C76.1 C77.1 R24.2 ; port VCC1V8_DDR
VCC3V3_S3: C57.1 D4.7(VSWOUT1) ; port VCC3V3_S3
VCC3V3_SYS: C56.1 C58.1 C80.2 D4.8(VCC8) D4.10(VCC12) R26.2 R28.2 VD4.1(A) VD5.2(C) ; port VCC3V3_SYS
VCC5V0_SYS: C37.1 C39.1 C42.1 C45.2 C46.1 C48.1 C54.1 C60.1 D4.1(VCC10) D4.4(VCC7) D4.13(VCC9) D4.16(VCC11) D4.23(VCC2) D4.24(VCC2) D4.32(VCC6) D4.35(VLDOA) D4.36(VCCA) D4.44(VCC1) D4.45(VCC1) D4.59(VCC3) D4.60(VCC4) ; port VCC5V0_SYS
VCC_1V5: C49.1 D4.2(VLDO6) R16.2 ; port VCC_1V5
VCC_1V8: C50.2 C51.2 C66.1 C67.1 C68.1 C69.1 C70.1 D4.63(VFB4) L4.1 R22.1 R23.1 R24.1 R25.2 ; port VCC_1V8
VCC_3V0: C55.1 C71.2 D4.15(VLDO8) D4.17(VDDIO) ; port VCC_3V0
VCC_DDR: C61.1 C64.1 C65.2 L6.1 R17.1 R17.2 R19.1 ; port VCC_DDR
VCC_LAN: C59.1 D4.11(VSWOUT2) ; port VCC_LAN
VCC_RTC: C73.2 D4.9(VCCRTC) D4.52(BOOT0) D4.53(BOOT1) R21.1
VCC_SDIO: C44.1 D4.12(VLDO4) ; port VCC_SDIO
VCCA0V9_HDMI: C43.1 D4.5(VLDO7) ; port VCCA0V9_HDMI
VCCA1V8_CODEC: C38.1 D4.31(VLDO1) ; port VCCA1V8_CODEC
VCCA1V8_HDMI: C40.1 D4.33(VLDO2) ; port VCCA1V8_HDMI
VCCA3V0_CODEC: C47.1 D4.14(VLDO5) ; port VCCA3V0_CODEC
VCCA_1V8: C41.1 D4.3(VLDO3) ; port VCCA_1V8
VDD_CENTER: C52.2 C53.2 L5.2 R15.1 ; port VDD_CENTER
VDD_CPU_L: C62.2 C63.2 L7.2 R18.1 ; port VDD_CPU_L
VPP_OTP: C78.2 D4.6(VPPOTP) R29.2 ; port VPP_OTP
NetC61_2: C61.2 D4.56(VFB3) R19.2 R20.2
NetC72_1: C72.1 D4.37(VREF)
NetD4_25: D4.25(SW2) D4.26(SW2) L7.1
NetD4_29: D4.29(VFB2) R18.2
NetD4_39: D4.39(VFB1) R15.2
NetD4_42: D4.42(SW1) D4.43(SW1) L5.1
NetD4_58: D4.58(SW3) L6.2
NetD4_61: D4.61(SW4) L4.2
NetR21_2: R21.2 VD4.2(C)

Not connected (* = marked no-connect by the designer): D4 47(NC) 48(NC) 54(DVSOK)

### Notes on the sheet
- Перв. примен.
- PG 2,3,4,11,12,17,18,19,20,21,23,25
- Trace>1.5A
- PG 3,4,9,14,15,17,18,19,20,24
- PG 3,5
- Trace>2.0A
- Справ. №
- PG 3,6,7
- Feedback from
  DDR IC
- PG 3,4,14
- PG 3,14
- Подп. и дата
- PG 3,7
- PG 3,13
- PG 2,3,4,9,10,12,17,18,23
- Инв. № дубл.
- PG 3,4
- PG 3,24
- PG 3,21
- PG 3,16
- PG 3,4,11,12,13,22,23
- PG 3,10
- PG 3,13,14
- PG 3,4,13,14,16,21
- PG 3,9,11,12,15
- PG 3,15
- Взам. инв. №
- Разраб.
- Изм.
- Лист
- № докум.
- Подп.
- Дата
- Лит.
- Масса
- Масштаб
- Пров.
- Т.контр.
- Листов
- Инв. № подл.
- Утв.
- Н.контр.
- 2.106-A3
- Копировал
- Формат А3
- (in symbol RK808-D, part A) DCDC1; DCDC4; Buck1; Buck4; 5A; 1.5A; 0.7V-1.5V; 1.8V-3.3V; DCDC2; DCDC3; Buck2; Buck3; 1.0V-1.8V
- (in symbol RK808-D, part B) LDO&Switch; 1.8-3.4V/150mA; 0.8-2.5V/100mA; low noise; 0.8-2.5V/300mA; 1.8-3.4V/300mA; 0.8-2.5V/150mA; 0.2R Switch

### Library data of the parts
BT1 = Button_Corner_4pin: ComponentType: *; Manufacter: *; Package: L-KLS7-TS6606-5.0-180; PartNumber: L-KLS7-TS6606-5.0-180; ClassName: *; Value: L-KLS7-TS6606-5.0-180
C37 C39 C42 C46 C48 C54 C56 C58 C73 = Ceramic_Cap: PartNumber: CC0402KRX5R6BB105; ComponentType: SMD Ceramic Chip Capacitor; Manufacter: *; Tolerance: *; ClassName: *; Value: 1uF
C38 C40 C43 C44 C47 C55 C59 = Ceramic_Cap: PartNumber: CC0402KRX5R6BB225; ComponentType: SMD Ceramic Chip Capacitor; Manufacter: *; Tolerance: *; ClassName: *; Value: 2.2uF
C41 C49 C57 C80 = Ceramic_Cap: PartNumber: CL05A475KP5NRNC; ComponentType: SMD Ceramic Chip Capacitor; Manufacter: *; Tolerance: *; ClassName: *; Value: 4.7uF
C45 C60 C64 C76 = Ceramic_Cap: PartNumber: CC0402MRX5R6BB106; ComponentType: SMD Ceramic Chip Capacitor; Manufacter: *; Tolerance: *; ClassName: *; Value: 10uF
C50-C53 C62 C63 C65 = Ceramic_Cap: PartNumber: CL10A226MP8NUNE; ComponentType: SMD Ceramic Chip Capacitor; Manufacter: *; Tolerance: *; ClassName: *; Value: 22uF
C61 = Ceramic_Cap: PartNumber: CC0402FRNPO9BN470; ComponentType: SMD Ceramic Chip Capacitor; Manufacter: *; Tolerance: *; ClassName: *; Value: 47pF
C66-C72 C77-C79 = Ceramic_Cap: PartNumber: CC0402KRX5R6BB104; ComponentType: SMD Ceramic Chip Capacitor; Manufacter: *; Tolerance: *; ClassName: *; Value: 0.1uF
C74 C75 = Ceramic_Cap: PartNumber: CC0402JRNPO9BN120; ComponentType: SMD Ceramic Chip Capacitor; Manufacter: *; Tolerance: *; ClassName: *; Value: 12pF
C81 = Ceramic_Cap: PartNumber: GRM155R61A223KA01D; ComponentType: SMD Ceramic Chip Capacitor; Manufacter: *; Tolerance: *; ClassName: *; Value: 0.022uF
L4 L6 = Inductor_smal: PartNumber: HEI252012A-2R2M-Q8; ComponentType: *; Manufacter: *; Package: HEI252012A; ClassName: *
L5 L7 = Inductor_smal: PartNumber: HEI252012A-1R0M-Q8; ComponentType: *; Manufacter: *; Package: HEI252012A; ClassName: *
R15 R17 R18 = Chip_Res: PartNumber: RC0402FR-07100RL; ComponentType: SMD Chip Resistor; Manufacter: *; Voltage: *; ClassName: *; Value: 100R
R16 R22 R23 R25 R26 R28 = Chip_Res: PartNumber: RC0402FR-0710KL; ComponentType: SMD Chip Resistor; Manufacter: *; Voltage: *; ClassName: *; Value: 10K
R19 = Chip_Res: PartNumber: RC0402FR-0751KL; ComponentType: SMD Chip Resistor; Manufacter: *; Voltage: *; ClassName: *; Value: 51K
R20 = Chip_Res: PartNumber: RC0402FR-07200KL; ComponentType: SMD Chip Resistor; Manufacter: *; Voltage: *; ClassName: *; Value: 200K
R21 = Chip_Res: PartNumber: RL0402FR-070R1L; ComponentType: SMD Chip Resistor; Manufacter: *; Voltage: *; ClassName: *; Value: 0R1
R24 R30 = Chip_Res: PartNumber: RC0402FR-070RL; ComponentType: SMD Chip Resistor; Manufacter: *; Voltage: *; ClassName: *; Value: 0R
R27 = Chip_Res: PartNumber: RC0402FR-072ML; ComponentType: SMD Chip Resistor; Manufacter: *; Voltage: *; ClassName: *; Value: 2M
R29 = Chip_Res: PartNumber: RC0402FR-071KL; ComponentType: SMD Chip Resistor; Manufacter: *; Voltage: *; ClassName: *; Value: 1K
VD4 VD6 = Diode: PartNumber: PMEG4010CEJ.115; ComponentType: *; Manufacter: *; Package: SOD323; ClassName: *
Z1 = OSC3215: PartNumber: SJK-7L-32.768-12.5-20-70-C; ComponentType: *; Manufacter: *; Package: TSX3215
D4 = RK808-D: ComponentType: SMD Chip Resistor; Manufacter: *; Voltage: *; ClassName: *; Tolerance: *; PartNumber: RK808-D; Package: QFN68; Value: RK808-D
VD5 = Diode: ComponentType: *; Manufacter: *; Package: SOD323; PartNumber: 1N4148WS; ClassName: *
VD7 = TVS_Diode: ComponentType: *; Manufacter: *; Package: SOD323; PartNumber: UDD32C05L01; ClassName: *

## Sheet 04 POWER.SchDoc
size 420 x 297 mm; Address1: Address1; Address2: Address2; Address3: Address3; Address4: Address4; DocumentNumber: АБВГ.123456.001 Э3; SheetNumber: 4; SheetTotal: 23; Scale: 1:1; DocumentType: Схема электрическая принципиальная; FirstReferrence: АБВГ.123456.001
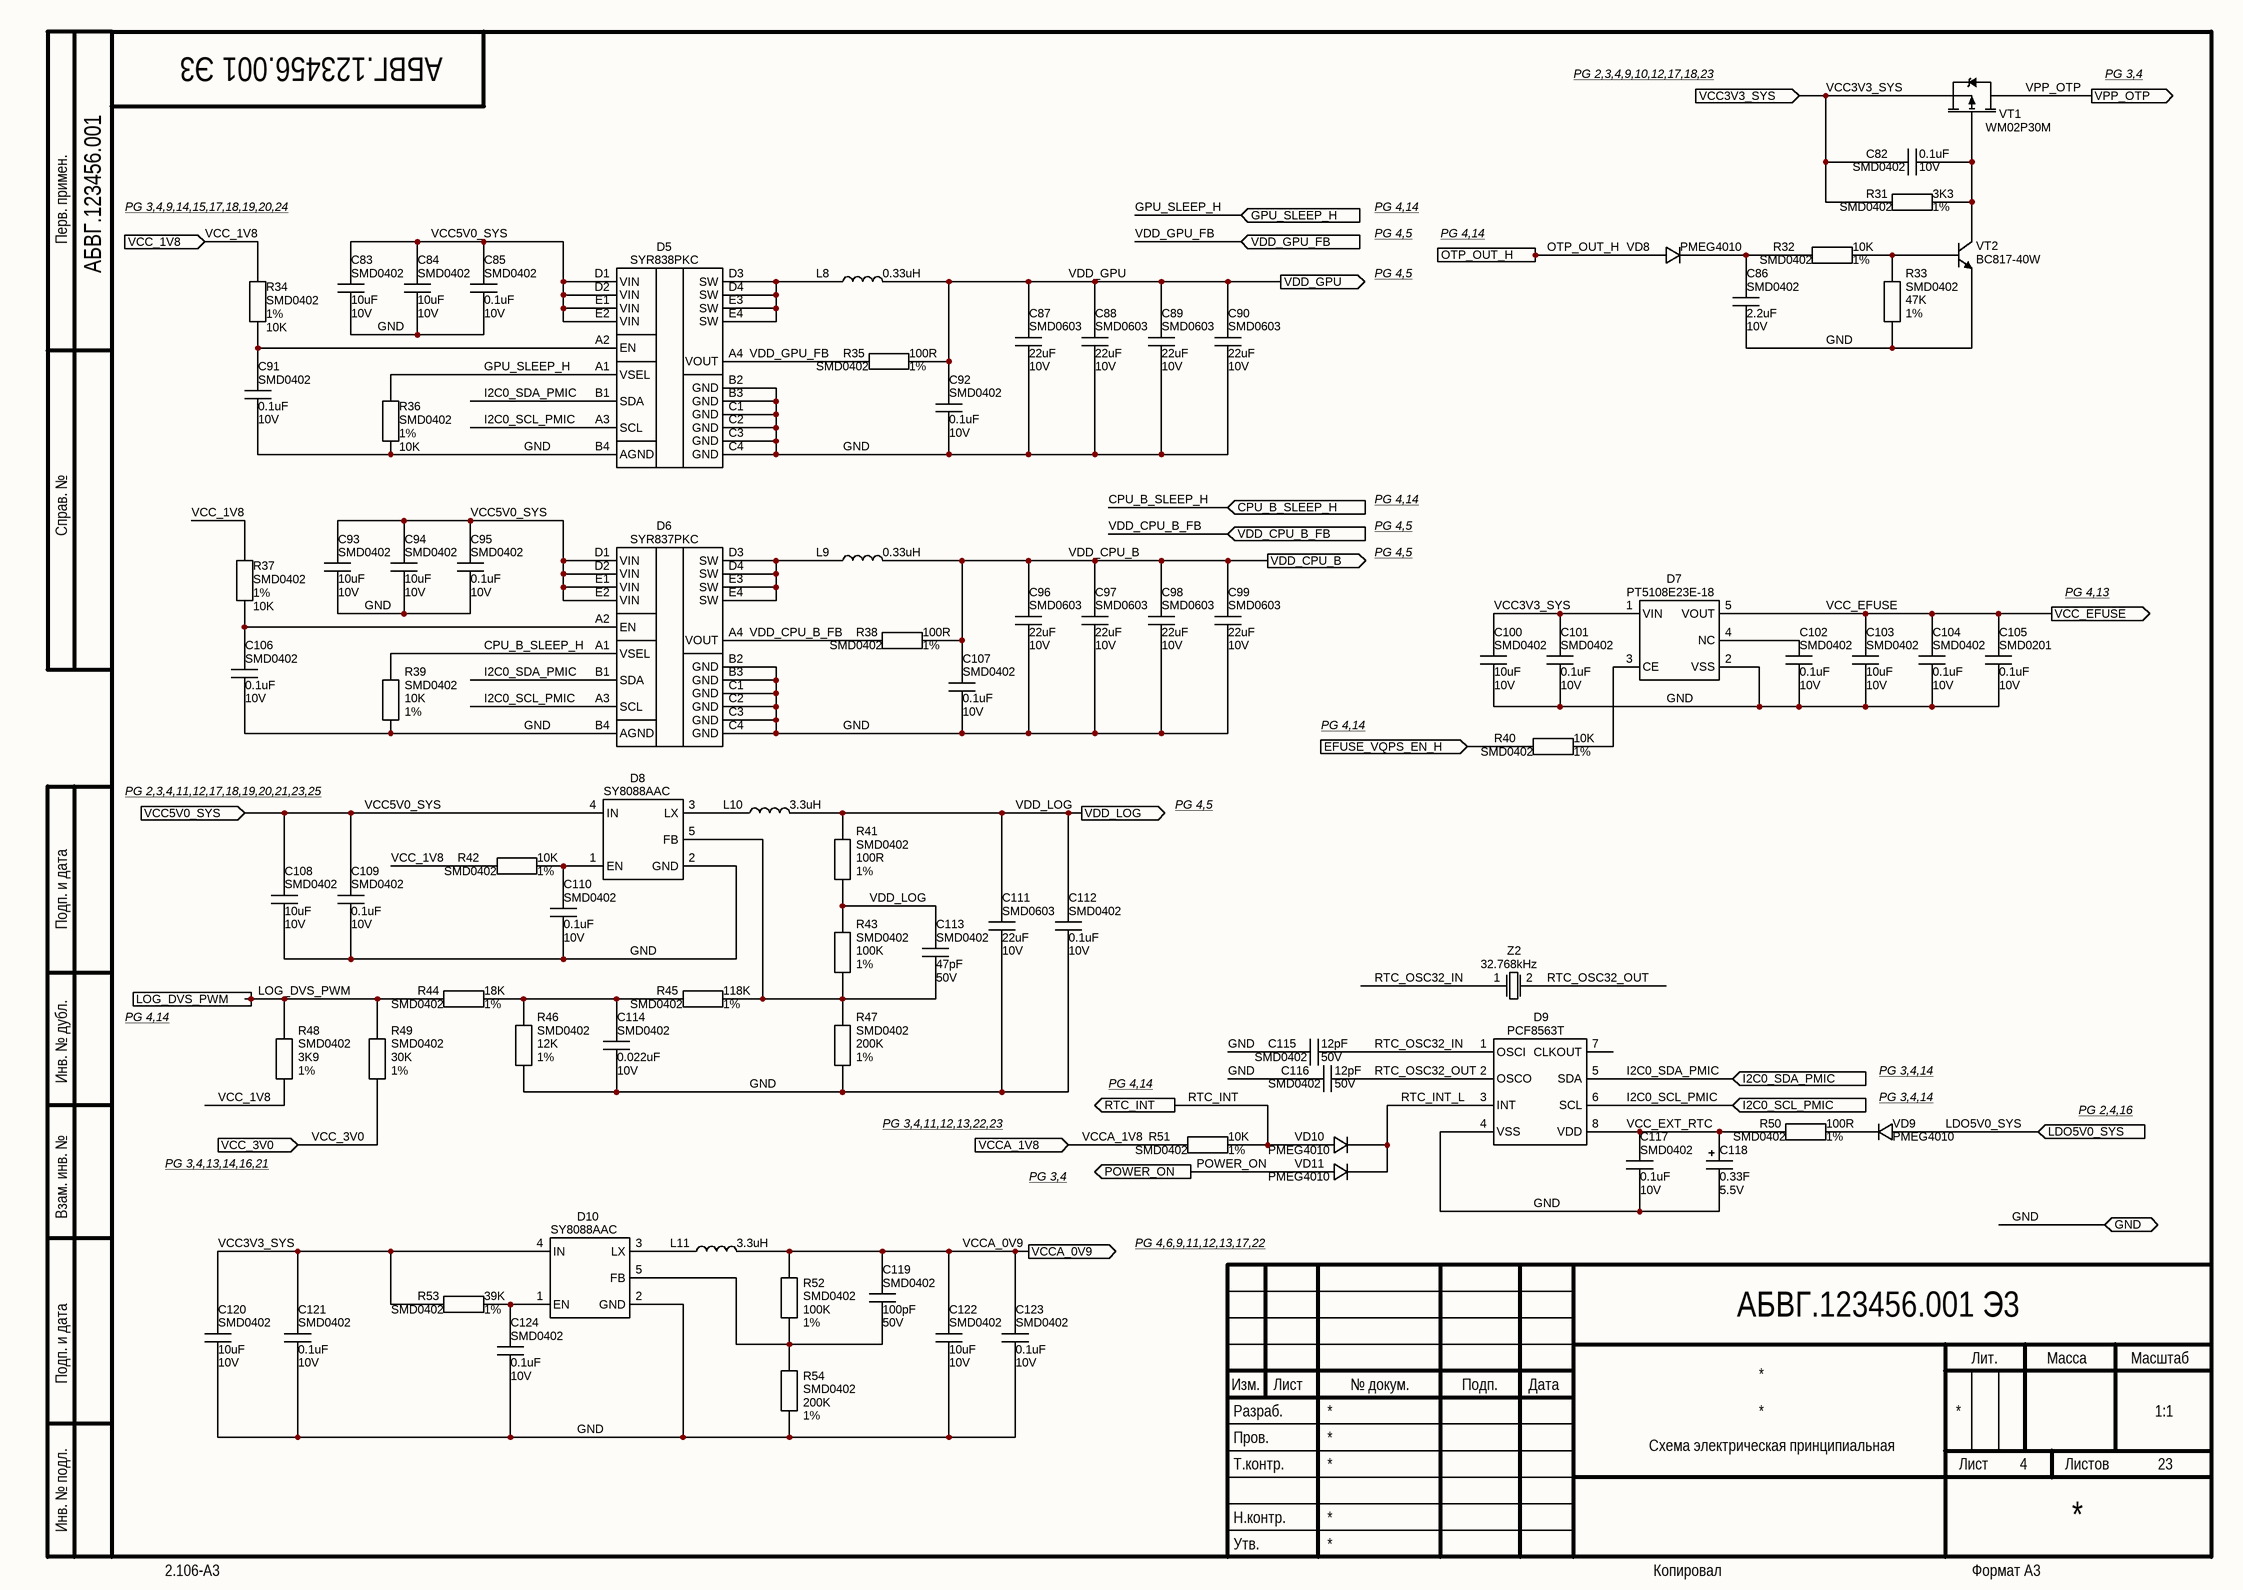
[diagram p3: 04 POWER.SchDoc]

### Parts
C82  Package: SMD0402  Voltage: 10V  [CAP_SMD_0402]  (hidden comment: 0.1uF)
C83  Package: SMD0402  Voltage: 10V  [CAP_SMD_0402]  (hidden comment: 10uF)
C84  Package: SMD0402  Voltage: 10V  [CAP_SMD_0402]  (hidden comment: 10uF)
C85  Package: SMD0402  Voltage: 10V  [CAP_SMD_0402]  (hidden comment: 0.1uF)
C86  Package: SMD0402  Voltage: 10V  [CAP_SMD_0402]  (hidden comment: 2.2uF)
C87  Package: SMD0603  Voltage: 10V  [CAP_SMD_0603]  (hidden comment: 22uF)
C88  Package: SMD0603  Voltage: 10V  [CAP_SMD_0603]  (hidden comment: 22uF)
C89  Package: SMD0603  Voltage: 10V  [CAP_SMD_0603]  (hidden comment: 22uF)
C90  Package: SMD0603  Voltage: 10V  [CAP_SMD_0603]  (hidden comment: 22uF)
C91  Package: SMD0402  Voltage: 10V  [CAP_SMD_0402]  (hidden comment: 0.1uF)
C92  Package: SMD0402  Voltage: 10V  [CAP_SMD_0402]  (hidden comment: 0.1uF)
C93  Package: SMD0402  Voltage: 10V  [CAP_SMD_0402]  (hidden comment: 10uF)
C94  Package: SMD0402  Voltage: 10V  [CAP_SMD_0402]  (hidden comment: 10uF)
C95  Package: SMD0402  Voltage: 10V  [CAP_SMD_0402]  (hidden comment: 0.1uF)
C96  Package: SMD0603  Voltage: 10V  [CAP_SMD_0603]  (hidden comment: 22uF)
C97  Package: SMD0603  Voltage: 10V  [CAP_SMD_0603]  (hidden comment: 22uF)
C98  Package: SMD0603  Voltage: 10V  [CAP_SMD_0603]  (hidden comment: 22uF)
C99  Package: SMD0603  Voltage: 10V  [CAP_SMD_0603]  (hidden comment: 22uF)
C100  Package: SMD0402  Voltage: 10V  [CAP_SMD_0402]  (hidden comment: 10uF)
C101  Package: SMD0402  Voltage: 10V  [CAP_SMD_0402]  (hidden comment: 0.1uF)
C102  Package: SMD0402  Voltage: 10V  [CAP_SMD_0402]  (hidden comment: 0.1uF)
C103  Package: SMD0402  Voltage: 10V  [CAP_SMD_0402]  (hidden comment: 10uF)
C104  Package: SMD0402  Voltage: 10V  [CAP_SMD_0402]  (hidden comment: 0.1uF)
C105  Package: SMD0201  Voltage: 10V  [CAP_SMD_0201]  (hidden comment: 0.1uF)
C106  Package: SMD0402  Voltage: 10V  [CAP_SMD_0402]  (hidden comment: 0.1uF)
C107  Package: SMD0402  Voltage: 10V  [CAP_SMD_0402]  (hidden comment: 0.1uF)
C108  Package: SMD0402  Voltage: 10V  [CAP_SMD_0402]  (hidden comment: 10uF)
C109  Package: SMD0402  Voltage: 10V  [CAP_SMD_0402]  (hidden comment: 0.1uF)
C110  Package: SMD0402  Voltage: 10V  [CAP_SMD_0402]  (hidden comment: 0.1uF)
C111  Package: SMD0603  Voltage: 10V  [CAP_SMD_0603]  (hidden comment: 22uF)
C112  Package: SMD0402  Voltage: 10V  [CAP_SMD_0402]  (hidden comment: 0.1uF)
C113  Package: SMD0402  Voltage: 50V  [CAP_SMD_0402]  (hidden comment: 47pF)
C114  Package: SMD0402  Voltage: 10V  [CAP_SMD_0402]  (hidden comment: 0.022uF)
C115  Package: SMD0402  Voltage: 50V  [CAP_SMD_0402]  (hidden comment: 12pF)
C116  Package: SMD0402  Voltage: 50V  [CAP_SMD_0402]  (hidden comment: 12pF)
C117  Package: SMD0402  Voltage: 10V  [CAP_SMD_0402]  (hidden comment: 0.1uF)
C118  Voltage: 5.5V  [DCS5R5_H]  (hidden comment: 0.33F)
C119  Package: SMD0402  Voltage: 50V  [CAP_SMD_0402]  (hidden comment: 100pF)
C120  Package: SMD0402  Voltage: 10V  [CAP_SMD_0402]  (hidden comment: 10uF)
C121  Package: SMD0402  Voltage: 10V  [CAP_SMD_0402]  (hidden comment: 0.1uF)
C122  Package: SMD0402  Voltage: 10V  [CAP_SMD_0402]  (hidden comment: 10uF)
C123  Package: SMD0402  Voltage: 10V  [CAP_SMD_0402]  (hidden comment: 0.1uF)
C124  Package: SMD0402  Voltage: 10V  [CAP_SMD_0402]  (hidden comment: 0.1uF)
D5  SYR838PKC  [WLCSP-20]
D6  SYR837PKC  [WLCSP-20]
D7  PT5108E23E-18  [SOT23-5]
D8  SY8088AAC  [SOT23-5]
D9  PCF8563T  [SO8]
D10  SY8088AAC  [SOT23-5]
L8  value 0.33uH  [HEI252012A]  (hidden comment: Value)
L9  value 0.33uH  [HEI252012A]  (hidden comment: Value)
L10  value 3.3uH  [HEI252012A]  (hidden comment: Value)
L11  value 3.3uH  [HEI252012A]  (hidden comment: Value)
R31  Package: SMD0402  Tolerance: 1%  [RES_SMD_0402]  (hidden comment: 3K3)
R32  Package: SMD0402  Tolerance: 1%  [RES_SMD_0402]  (hidden comment: 10K)
R33  Package: SMD0402  Tolerance: 1%  [RES_SMD_0402]  (hidden comment: 47K)
R34  Package: SMD0402  Tolerance: 1%  [RES_SMD_0402]  (hidden comment: 10K)
R35  Package: SMD0402  Tolerance: 1%  [RES_SMD_0402]  (hidden comment: 100R)
R36  Package: SMD0402  Tolerance: 1%  [RES_SMD_0402]  (hidden comment: 10K)
R37  Package: SMD0402  Tolerance: 1%  [RES_SMD_0402]  (hidden comment: 10K)
R38  Package: SMD0402  Tolerance: 1%  [RES_SMD_0402]  (hidden comment: 100R)
R39  Package: SMD0402  Tolerance: 1%  [RES_SMD_0402]  (hidden comment: 10K)
R40  Package: SMD0402  Tolerance: 1%  [RES_SMD_0402]  (hidden comment: 10K)
R41  Package: SMD0402  Tolerance: 1%  [RES_SMD_0402]  (hidden comment: 100R)
R42  Package: SMD0402  Tolerance: 1%  [RES_SMD_0402]  (hidden comment: 10K)
R43  Package: SMD0402  Tolerance: 1%  [RES_SMD_0402]  (hidden comment: 100K)
R44  Package: SMD0402  Tolerance: 1%  [RES_SMD_0402]  (hidden comment: 18K)
R45  Package: SMD0402  Tolerance: 1%  [RES_SMD_0402]  (hidden comment: 118K)
R46  Package: SMD0402  Tolerance: 1%  [RES_SMD_0402]  (hidden comment: 12K)
R47  Package: SMD0402  Tolerance: 1%  [RES_SMD_0402]  (hidden comment: 200K)
R48  Package: SMD0402  Tolerance: 1%  [RES_SMD_0402]  (hidden comment: 3K9)
R49  Package: SMD0402  Tolerance: 1%  [RES_SMD_0402]  (hidden comment: 30K)
R50  Package: SMD0402  Tolerance: 1%  [RES_SMD_0402]  (hidden comment: 100R)
R51  Package: SMD0402  Tolerance: 1%  [RES_SMD_0402]  (hidden comment: 10K)
R52  Package: SMD0402  Tolerance: 1%  [RES_SMD_0402]  (hidden comment: 100K)
R53  Package: SMD0402  Tolerance: 1%  [RES_SMD_0402]  (hidden comment: 39K)
R54  Package: SMD0402  Tolerance: 1%  [RES_SMD_0402]  (hidden comment: 200K)
VD8  value PMEG4010  [SOD323]  (hidden comment: Diode)
VD9  value PMEG4010  [SOD323]  (hidden comment: Diode)
VD10  value PMEG4010  [SOD323]  (hidden comment: Diode)
VD11  value PMEG4010  [SOD323]  (hidden comment: Diode)
VT1  value WM02P30M  [SOT23]  (hidden comment: Value)
VT2  BC817-40W  [SC-70]
Z2  value 32.768kHz  [TSX3215]  (hidden comment: Value)

### Ports
CPU_B_SLEEP_H (in), EFUSE_VQPS_EN_H (in), GND (bidir), GPU_SLEEP_H (in), I2C0_SCL_PMIC (in), I2C0_SDA_PMIC (in), LDO5V0_SYS (in), LOG_DVS_PWM (in), OTP_OUT_H (in), POWER_ON (out), RTC_INT (out), VCC3V3_SYS (in), VCC5V0_SYS (in), VCC_1V8 (in), VCC_3V0 (in), VCC_EFUSE (out), VCCA_0V9 (out), VCCA_1V8 (in), VDD_CPU_B (out), VDD_CPU_B_FB (in), VDD_GPU (out), VDD_GPU_FB (in), VDD_LOG (out), VPP_OTP (out)

### Nets
CPU_B_SLEEP_H: D6.A1(VSEL) R39.2 ; port CPU_B_SLEEP_H
EFUSE_VQPS_EN_H: R40.2 ; port EFUSE_VQPS_EN_H
GND: C83.2 C84.2 C85.2 C86.1 C87.1 C88.1 C89.1 C90.1 C91.2 C92.2 C93.2 C94.2 C95.2 C96.1 C97.1 C98.1 C99.1 C100.2 C101.2 C102.2 C103.2 C104.2 C105.2 C106.2 C107.2 C108.2 C109.2 C110.2 C111.1 C112.2 C114.2 C115.2 C116.2 C117.2 C118.2 C120.2 C121.2 C122.2 C123.2 C124.2 D5.B2(GND) D5.B3(GND) D5.B4(AGND) D5.C1(GND) D5.C2(GND) D5.C3(GND) D5.C4(GND) D6.B2(GND) D6.B3(GND) D6.B4(AGND) D6.C1(GND) D6.C2(GND) D6.C3(GND) D6.C4(GND) D7.2(VSS) D8.2(GND) D9.4(VSS) D10.2(GND) R33.1 R36.1 R39.1 R46.1 R47.1 R54.1 VT2.2(E) ; port GND
GPU_SLEEP_H: D5.A1(VSEL) R36.2 ; port GPU_SLEEP_H
I2C0_SCL_PMIC: D5.A3(SCL) D6.A3(SCL) D9.6(SCL) ; port I2C0_SCL_PMIC
I2C0_SDA_PMIC: D5.B1(SDA) D6.B1(SDA) D9.5(SDA) ; port I2C0_SDA_PMIC
LDO5V0_SYS: VD9.1(A) ; port LDO5V0_SYS
LOG_DVS_PWM: R44.1 R48.2 R49.2 ; port LOG_DVS_PWM
OTP_OUT_H: VD8.1(A) ; port OTP_OUT_H
POWER_ON: VD11.1(A) ; port POWER_ON
RTC_INT: R51.1 VD10.1(A) ; port RTC_INT
RTC_INT_L: D9.3(INT) VD10.2(C) VD11.2(C)
RTC_OSC32_IN: C115.1 D9.1(OSCI) Z2.1
RTC_OSC32_OUT: C116.1 D9.2(OSCO) Z2.2
VCC3V3_SYS: C82.1 C100.1 C101.1 C120.1 C121.1 D7.1(VIN) D10.4(IN) R31.1 R53.1 VT1.2(S) ; port VCC3V3_SYS
VCC5V0_SYS: C83.1 C84.1 C85.1 C93.1 C94.1 C95.1 C108.1 C109.1 D5.D1(VIN) D5.D2(VIN) D5.E1(VIN) D5.E2(VIN) D6.D1(VIN) D6.D2(VIN) D6.E1(VIN) D6.E2(VIN) D8.4(IN) ; port VCC5V0_SYS
VCC_1V8: R34.2 R37.2 R42.2 R48.1 ; port VCC_1V8
VCC_3V0: R49.1 ; port VCC_3V0
VCC_EFUSE: C103.1 C104.1 C105.1 D7.5(VOUT) ; port VCC_EFUSE
VCC_EXT_RTC: C117.1 C118.1 D9.8(VDD) R50.1
VCCA_0V9: C119.1 C122.1 C123.1 L11.1 R52.2 ; port VCCA_0V9
VCCA_1V8: R51.2 ; port VCCA_1V8
VDD_CPU_B: C96.2 C97.2 C98.2 C99.2 C107.1 L9.1 R38.2 ; port VDD_CPU_B
VDD_CPU_B_FB: D6.A4(VOUT) R38.1 ; port VDD_CPU_B_FB
VDD_GPU: C87.2 C88.2 C89.2 C90.2 C92.1 L8.1 R35.2 ; port VDD_GPU
VDD_GPU_FB: D5.A4(VOUT) R35.1 ; port VDD_GPU_FB
VDD_LOG: C111.2 C112.1 C113.1 L10.1 R41.1 R41.2 R43.2 ; port VDD_LOG
VPP_OTP: VT1.3(D) ; port VPP_OTP
NetC82_2: C82.2 R31.2 VT1.1(G) VT2.3(C)
NetC86_2: C86.2 R32.2 VD8.2(C)
NetC91_1: C91.1 D5.A2(EN) R34.1
NetC102_1: C102.1 D7.4(NC)
NetC106_1: C106.1 D6.A2(EN) R37.1
NetC110_1: C110.1 D8.1(EN) R42.1
NetC113_2: C113.2 D8.5(FB) R43.1 R45.2 R47.2
NetC114_1: C114.1 R44.2 R45.1 R46.2
NetC119_2: C119.2 D10.5(FB) R52.1 R54.2
NetC124_1: C124.1 D10.1(EN) R53.2
NetD5_D3: D5.D3(SW) D5.D4(SW) D5.E3(SW) D5.E4(SW) L8.2
NetD6_D3: D6.D3(SW) D6.D4(SW) D6.E3(SW) D6.E4(SW) L9.2
NetD7_3: D7.3(CE) R40.1
NetD8_3: D8.3(LX) L10.2
NetD10_3: D10.3(LX) L11.2
NetR32_1: R32.1 R33.2 VT2.1(B)
NetR50_2: R50.2 VD9.2(C)

Not connected (* = marked no-connect by the designer): D9 7(CLKOUT)

### Notes on the sheet
- PG 2,3,4,9,10,12,17,18,23
- PG 3,4
- Перв. примен.
- PG 3,4,9,14,15,17,18,19,20,24
- PG 4,14
- PG 4,5
- Справ. №
- PG 4,13
- PG 2,3,4,11,12,17,18,19,20,21,23,25
- Подп. и дата
- Инв. № дубл.
- PG 3,4,11,12,13,22,23
- PG 3,4,14
- (near VD9) PG 3,4,14
- PG 2,4,16
- PG 3,4,13,14,16,21
- Взам. инв. №
- PG 4,6,9,11,12,13,17,22
- Разраб.
- Изм.
- Лист
- № докум.
- Подп.
- Дата
- Лит.
- Масса
- Масштаб
- Пров.
- Т.контр.
- Листов
- Инв. № подл.
- Утв.
- Н.контр.
- 2.106-A3
- Копировал
- Формат А3

### Library data of the parts
C82 C85 C91 C92 C95 C101 C102 C104 C106 C107 C109 C110 C112 C117 C121 C123 C124 = Ceramic_Cap: PartNumber: CC0402KRX5R6BB104; ComponentType: SMD Ceramic Chip Capacitor; Manufacter: *; Tolerance: *; ClassName: *; Value: 0.1uF
C83 C84 C93 C94 C100 C103 C108 C120 C122 = Ceramic_Cap: PartNumber: CC0402MRX5R6BB106; ComponentType: SMD Ceramic Chip Capacitor; Manufacter: *; Tolerance: *; ClassName: *; Value: 10uF
C86 = Ceramic_Cap: PartNumber: CC0402KRX5R6BB225; ComponentType: SMD Ceramic Chip Capacitor; Manufacter: *; Tolerance: *; ClassName: *; Value: 2.2uF
C87-C90 C96-C99 C111 = Ceramic_Cap: PartNumber: CL10A226MP8NUNE; ComponentType: SMD Ceramic Chip Capacitor; Manufacter: *; Tolerance: *; ClassName: *; Value: 22uF
C105 = Ceramic_Cap: PartNumber: CC0201KRX5R6BB104; ComponentType: SMD Ceramic Chip Capacitor; Manufacter: *; Tolerance: *; ClassName: *; Value: 0.1uF
C113 = Ceramic_Cap: PartNumber: CC0402FRNPO9BN470; ComponentType: SMD Ceramic Chip Capacitor; Manufacter: *; Tolerance: *; ClassName: *; Value: 47pF
C114 = Ceramic_Cap: PartNumber: GRM155R61A223KA01D; ComponentType: SMD Ceramic Chip Capacitor; Manufacter: *; Tolerance: *; ClassName: *; Value: 0.022uF
C115 C116 = Ceramic_Cap: PartNumber: CC0402JRNPO9BN120; ComponentType: SMD Ceramic Chip Capacitor; Manufacter: *; Tolerance: *; ClassName: *; Value: 12pF
C118 = AluminiumCap: PartNumber: DCS5R5334HF; Tolerance: ±20%; Manufacturer: *; Package: DCS5R5_H; ComponentType: *; ClassName: *; Value: 0.33F
C119 = Ceramic_Cap: PartNumber: CC0402KRNPO9BN101; ComponentType: SMD Ceramic Chip Capacitor; Manufacter: *; Tolerance: *; ClassName: *; Value: 100pF
D6 = SYR838PKC: ComponentType: SMD Chip Resistor; Manufacter: *; Voltage: *; ClassName: *; Tolerance: *; PartNumber: SYR837PKC; Package: WLCSP-20; Value: SYR837PKC
D7 = PT5108E23E-30: ComponentType: SMD Chip Resistor; Manufacter: *; Voltage: *; ClassName: *; Tolerance: *; PartNumber: PT5108E23E-18; Package: SOT23-5; Value: PT5108E23E-18
L8 L9 = Inductor_smal: PartNumber: HEI252012A-R33M-Q8; ComponentType: *; Manufacter: *; Package: HEI252012A; ClassName: *
L10 L11 = Inductor_smal: PartNumber: WPN252012H3R3MT; ComponentType: *; Manufacter: *; Package: WPN252012; ClassName: *
R31 = Chip_Res: PartNumber: RC0402FR-073K3L; ComponentType: SMD Chip Resistor; Manufacter: *; Voltage: *; ClassName: *; Value: 3K3
R32 R34 R36 R37 R39 R40 R42 R51 = Chip_Res: PartNumber: RC0402FR-0710KL; ComponentType: SMD Chip Resistor; Manufacter: *; Voltage: *; ClassName: *; Value: 10K
R33 = Chip_Res: PartNumber: RC0402FR-1347KL; ComponentType: SMD Chip Resistor; Manufacter: *; Voltage: *; ClassName: *; Value: 47K
R35 R38 R41 R50 = Chip_Res: PartNumber: RC0402FR-07100RL; ComponentType: SMD Chip Resistor; Manufacter: *; Voltage: *; ClassName: *; Value: 100R
R43 R52 = Chip_Res: PartNumber: RC0402FR-07100KL; ComponentType: SMD Chip Resistor; Manufacter: *; Voltage: *; ClassName: *; Value: 100K
R44 = Chip_Res: PartNumber: RC0402FR-0718KL; ComponentType: SMD Chip Resistor; Manufacter: *; Voltage: *; ClassName: *; Value: 18K
R45 = Chip_Res: PartNumber: RC0402FR-07118KL; ComponentType: SMD Chip Resistor; Manufacter: *; Voltage: *; ClassName: *; Value: 118K
R46 = Chip_Res: PartNumber: RC0402FR-0712KL; ComponentType: SMD Chip Resistor; Manufacter: *; Voltage: *; ClassName: *; Value: 12K
R47 R54 = Chip_Res: PartNumber: RC0402FR-07200KL; ComponentType: SMD Chip Resistor; Manufacter: *; Voltage: *; ClassName: *; Value: 200K
R48 = Chip_Res: PartNumber: RC0402FR-073K9L; ComponentType: SMD Chip Resistor; Manufacter: *; Voltage: *; ClassName: *; Value: 3K9
R49 = Chip_Res: PartNumber: RC0402FR-0730KL; ComponentType: SMD Chip Resistor; Manufacter: *; Voltage: *; ClassName: *; Value: 30K
R53 = Chip_Res: PartNumber: RC0402FR-0739KL; ComponentType: SMD Chip Resistor; Manufacter: *; Voltage: *; ClassName: *; Value: 39K
VD8-VD11 = Diode: PartNumber: PMEG4010CEJ.115; ComponentType: *; Manufacter: *; Package: SOD323; ClassName: *
VT1 = MOSFET_P: ComponentType: *; Manufacter: *; Package: SOT23; PartNumber: WM02P30M; ClassName: *
VT2 = NPN_BEC: ComponentType: *; Manufacter: *; Package: SC-70; PartNumber: BC817-40W; ClassName: *; Value: BC817-40W
Z2 = OSC3215: PartNumber: SJK-7L-32.768-12.5-20-70-C; ComponentType: *; Manufacter: *; Package: TSX3215
D5 = SYR838PKC: ComponentType: SMD Chip Resistor; Manufacter: *; Voltage: *; ClassName: *; Tolerance: *; PartNumber: SYR838PKC; Package: WLCSP-20; Value: SYR838PKC
D8 D10 = SY8088AAC: ComponentType: SMD Chip Resistor; Manufacter: *; Voltage: *; ClassName: *; Tolerance: *; PartNumber: SY8088AAC; Package: SOT23-5; Value: SY8088AAC
D9 = PCF8563T: ComponentType: SMD Chip Resistor; Manufacter: *; Voltage: *; ClassName: *; Tolerance: *; PartNumber: PCF8563T; Package: SO8; Value: PCF8563T